# EAGLE design untitled (EAGLE 9.6.2)
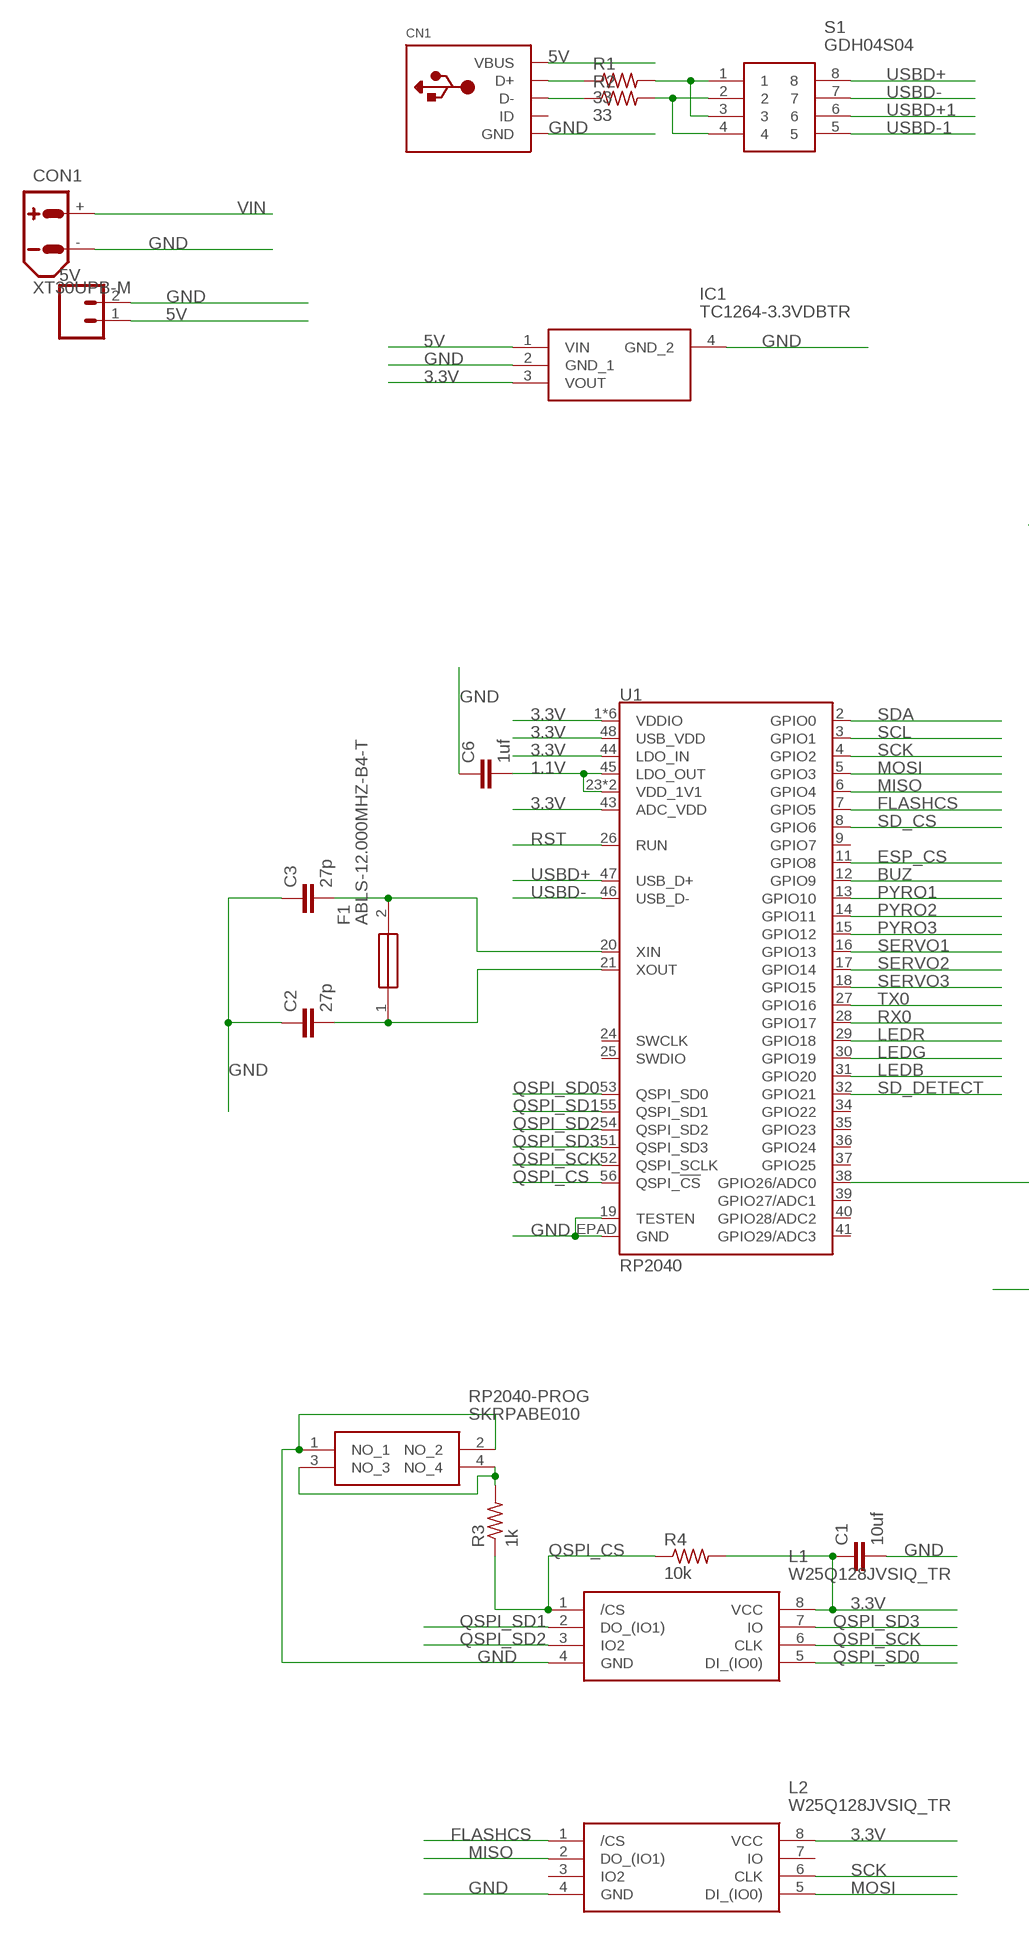
[diagram p0: schematic, sheet 1, part 1 of 2]
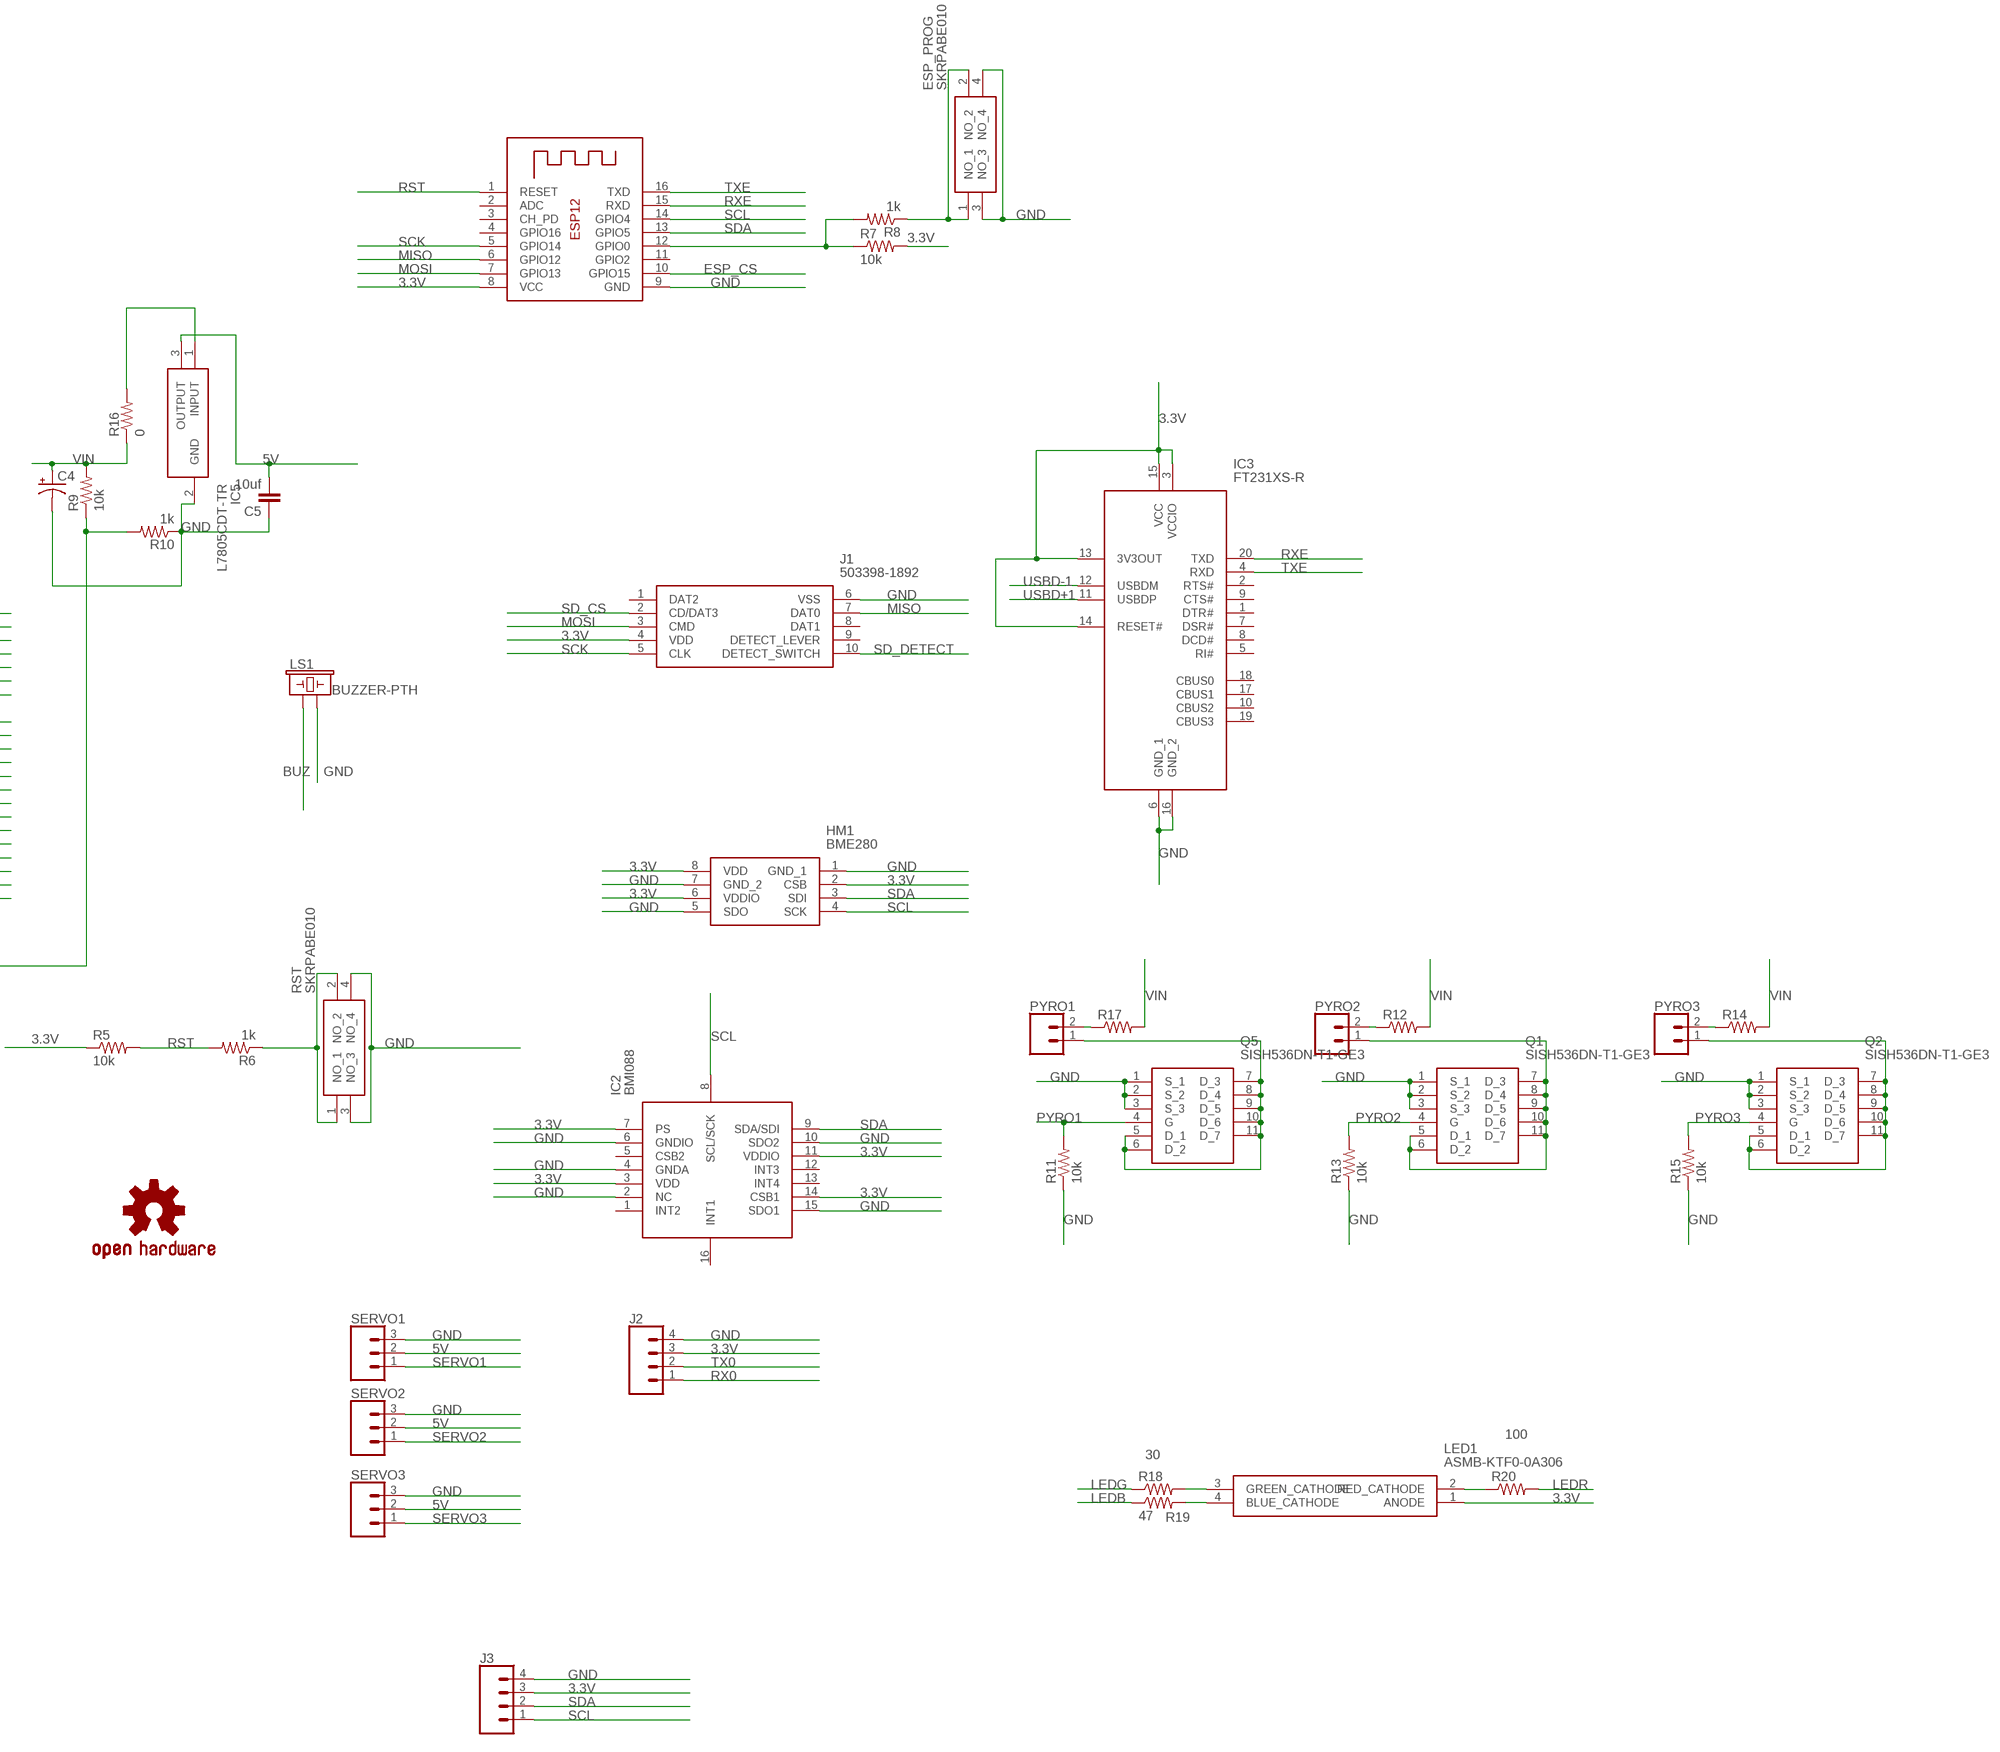
[diagram p1: schematic, sheet 1, part 2 of 2]

## Parts
5V  CONN_02  [1X02]
C1  10uf  C-EUC0805  [C0805]
C2  27p  C-EUC0805  [C0805]
C3  27p  C-EUC0805  [C0805]
C4  CPOL-USE3.5-8  [E3,5-8]
C5  10uf  C-EUC0805  [C0805]
C6  1uf  C-EUC0805  [C0805]
CN1  USBMINIB  [USB-MINIB]
CON1  XT30UPB-M  [XT30UPB-M]
ESP_PROG  SKRPABE010  [SKRPABE010]
F1  ABLS-12.000MHZ-B4-T  [HC/49US-(AT49)_1]
HM1  BME280  [BME280]
IC1  TC1264-3.3VDBTR  [SOT230P700X180-4N]
IC2  BMI088  [BMI088]
IC3  FT231XS-R  [SOP64P599X175-20N]
IC5  L7805CDT-TR  [L7805CDTTR]
J1  503398-1892  [503398-1892]
J2  CONN_04  [1X04]
J3  CONN_04  [1X04]
L1  W25Q128JVSIQ_TR  [SOIC127P780X195-8N]
L2  W25Q128JVSIQ_TR  [SOIC127P780X195-8N]
LED1  ASMB-KTF0-0A306  [ASMBKTF00A306]
LOGO1  OSHW-LOGOS  [OSHW-LOGO-S]
LS1  BUZZER-PTH  [BUZZER-12MM]
PYRO1  CONN_025MM  [SCREWTERMINAL-5MM-2]
PYRO2  CONN_025MM  [SCREWTERMINAL-5MM-2]
PYRO3  CONN_025MM  [SCREWTERMINAL-5MM-2]
Q1  SISH536DN-T1-GE3  [SQSA80ENWT1_GE3]
Q2  SISH536DN-T1-GE3  [SQSA80ENWT1_GE3]
Q5  SISH536DN-T1-GE3  [SQSA80ENWT1_GE3]
R1  33  R-US_M0805  [M0805]
R2  33  R-US_M0805  [M0805]
R3  1k  R-US_M0805  [M0805]
R4  10k  R-US_M0805  [M0805]
R5  10k  R-US_M0805  [M0805]
R6  1k  R-US_M0805  [M0805]
R7  10k  R-US_M0805  [M0805]
R8  1k  R-US_M0805  [M0805]
R9  10k  R-US_M0805  [M0805]
R10  1k  R-US_M0805  [M0805]
R11  10k  R-US_M0805  [M0805]
R12  0  R-US_R2512  [R2512]
R13  10k  R-US_M0805  [M0805]
R14  0  R-US_R2512  [R2512]
R15  10k  R-US_M0805  [M0805]
R16  0  R-US_R2512  [R2512]
R17  0  R-US_R2512  [R2512]
R18  30  R-US_M0805  [M0805]
R19  47  R-US_M0805  [M0805]
R20  100  R-US_M0805  [M0805]
RP2040-PROG  SKRPABE010  [SKRPABE010]
RST  SKRPABE010  [SKRPABE010]
S1  GDH04S04  [SOIC127P813X256-8N]
SERVO1  CONN_03  [1X03]
SERVO2  CONN_03  [1X03]
SERVO3  CONN_03  [1X03]
U1  RP2040  [QFN-56]
X1  ESP-12  [ESP-12]

## Nets
1.1V: C6.2 U1.23(VDD_1V1) U1.45(LDO_OUT) U1.50(VDD_1V1)
3.3V: C1.1 HM1.2(CSB) HM1.6(VDDIO) HM1.8(VDD) IC1.3(VOUT) IC2.3(VDD) IC2.7(PS) IC2.11(VDDIO) IC2.14(CSB1) IC3.3(VCCIO) IC3.13(3V3OUT) IC3.14(RESET#) IC3.15(VCC) J1.4(VDD) J2.3 J3.3 L1.8(VCC) L2.8(VCC) LED1.1(ANODE) R4.2 R5.1 R7.2 U1.1(VDDIO) U1.10(VDDIO) U1.22(VDDIO) U1.33(VDDIO) U1.42(VDDIO) U1.43(ADC_VDD) U1.44(LDO_IN) U1.48(USB_VDD) U1.49(VDDIO) X1.8(VCC)
5V: 5V.1 C5.2 CN1.VBUS IC1.1(VIN) IC5.3(OUTPUT) SERVO1.2 SERVO2.2 SERVO3.2
BUZ: LS1.+ U1.12(GPIO9)
ESP_CS: U1.11(GPIO8) X1.10(GPIO15)
FLASHCS: L2.1(/CS) U1.7(GPIO5)
GND: 5V.2 C1.2 C2.1 C3.1 C4.- C5.1 C6.1 CN1.GND CON1.- ESP_PROG.3(NO_3) ESP_PROG.4(NO_4) HM1.1(GND_1) HM1.5(SDO) HM1.7(GND_2) IC1.2(GND_1) IC1.4(GND_2) IC2.2(NC) IC2.4(GNDA) IC2.6(GNDIO) IC2.10(SDO2) IC2.15(SDO1) IC3.6(GND_1) IC3.16(GND_2) IC5.2(GND) J1.6(VSS) J2.4 J3.4 L1.4(GND) L2.4(GND) LS1.- Q1.1(S_1) Q1.2(S_2) Q1.3(S_3) Q2.1(S_1) Q2.2(S_2) Q2.3(S_3) Q5.1(S_1) Q5.2(S_2) Q5.3(S_3) R10.1 R11.1 R13.1 R15.1 RP2040-PROG.1(NO_1) RP2040-PROG.2(NO_2) RST.3(NO_3) RST.4(NO_4) SERVO1.3 SERVO2.3 SERVO3.3 U1.19(TESTEN) U1.EPAD(GND) X1.9(GND)
LEDB: R19.1 U1.31(GPIO20)
LEDG: R18.1 U1.30(GPIO19)
LEDR: R20.2 U1.29(GPIO18)
MISO: J1.7(DAT0) L2.2(DO_(IO1)) U1.6(GPIO4) X1.6(GPIO12)
MOSI: J1.3(CMD) L2.5(DI_(IO0)) U1.5(GPIO3) X1.7(GPIO13)
N$1: PYRO2.2 R12.1
N$2: R3.2 RP2040-PROG.3(NO_3) RP2040-PROG.4(NO_4)
N$3: ESP_PROG.1(NO_1) ESP_PROG.2(NO_2) R8.1
N$4: R6.1 RST.1(NO_1) RST.2(NO_2)
N$5: CN1.D+ R1.1
N$6: CN1.D- R2.1
N$7: PYRO2.1 Q1.5(D_1) Q1.6(D_2) Q1.7(D_3) Q1.8(D_4) Q1.9(D_5) Q1.10(D_6) Q1.11(D_7)
N$8: PYRO3.2 R14.1
N$9: PYRO1.1 Q5.5(D_1) Q5.6(D_2) Q5.7(D_3) Q5.8(D_4) Q5.9(D_5) Q5.10(D_6) Q5.11(D_7)
N$10: R7.1 R8.2 X1.12(GPIO0)
N$11: PYRO3.1 Q2.5(D_1) Q2.6(D_2) Q2.7(D_3) Q2.8(D_4) Q2.9(D_5) Q2.10(D_6) Q2.11(D_7)
N$13: R1.2 S1.1 S1.3
N$14: IC5.1(INPUT) R16.2
N$16: PYRO1.2 R17.1
N$17: R2.2 S1.2 S1.4
N$18: C3.2 F1.2 U1.20(XIN)
N$19: C2.2 F1.1 U1.21(XOUT)
N$23: LED1.3(GREEN_CATHODE) R18.2
N$24: R9.1 R10.2 U1.38(GPIO26/ADC0)
N$25: LED1.4(BLUE_CATHODE) R19.2
N$26: LED1.2(RED_CATHODE) R20.1
PYRO1: Q5.4(G) R11.2 U1.13(GPIO10)
PYRO2: Q1.4(G) R13.2 U1.14(GPIO11)
PYRO3: Q2.4(G) R15.2 U1.15(GPIO12)
QSPI_CS: L1.1(/CS) R3.1 R4.1 U1.56(QSPI_!CS!)
QSPI_SCK: L1.6(CLK) U1.52(QSPI_SCLK)
QSPI_SD0: L1.5(DI_(IO0)) U1.53(QSPI_SD0)
QSPI_SD1: L1.2(DO_(IO1)) U1.55(QSPI_SD1)
QSPI_SD2: L1.3(IO2) U1.54(QSPI_SD2)
QSPI_SD3: L1.7(IO) U1.51(QSPI_SD3)
RST: R5.2 R6.2 U1.26(RUN) X1.1(RESET)
RX0: J2.1 U1.28(GPIO17)
RXE: IC3.20(TXD) X1.15(RXD)
SCK: J1.5(CLK) L2.6(CLK) U1.4(GPIO2) X1.5(GPIO14)
SCL: HM1.4(SCK) IC2.8(SCL/SCK) J3.1 U1.3(GPIO1) X1.14(GPIO4)
SD_CS: J1.2(CD/DAT3) U1.8(GPIO6)
SD_DETECT: J1.10(DETECT_SWITCH) U1.32(GPIO21)
SDA: HM1.3(SDI) IC2.9(SDA/SDI) J3.2 U1.2(GPIO0) X1.13(GPIO5)
SERVO1: SERVO1.1 U1.16(GPIO13)
SERVO2: SERVO2.1 U1.17(GPIO14)
SERVO3: SERVO3.1 U1.18(GPIO15)
TX0: J2.2 U1.27(GPIO16)
TXE: IC3.4(RXD) X1.16(TXD)
USBD+: S1.8 U1.47(USB_D+)
USBD+1: IC3.11(USBDP) S1.6
USBD-: S1.7 U1.46(USB_D-)
USBD-1: IC3.12(USBDM) S1.5
VIN: C4.+ CON1.+ R9.2 R12.2 R14.2 R16.1 R17.2
Unconnected: CN1.ID IC2.1(INT2) IC2.5(CSB2) IC2.12(INT3) IC2.13(INT4) IC2.16(INT1) IC3.1(DTR#) IC3.2(RTS#) IC3.5(RI#) IC3.7(DSR#) IC3.8(DCD#) IC3.9(CTS#) IC3.10(CBUS2) IC3.17(CBUS1) IC3.18(CBUS0) IC3.19(CBUS3) J1.1(DAT2) J1.8(DAT1) J1.9(DETECT_LEVER) L2.3(IO2) L2.7(IO) U1.9(GPIO7) U1.24(SWCLK) U1.25(SWDIO) U1.34(GPIO22) U1.35(GPIO23) U1.36(GPIO24) U1.37(GPIO25) U1.39(GPIO27/ADC1) U1.40(GPIO28/ADC2) U1.41(GPIO29/ADC3) X1.2(ADC) X1.3(CH_PD) X1.4(GPIO16) X1.11(GPIO2)

## Library data of the parts
5V = SparkFun-Connectors:CONN_02: Multi connection point. Often used as Generic Header-pin footprint for 0.1 inch spaced/style header connections On any of the 0.1 inch spaced packages, you can populate with these: Break Away Headers - Straight <https://www.sparkfun.com/products/116> (PRT-00116) Break Away Male Headers - Right Angle <https://www.sparkfun.com/products/553> (PRT-00553) Female Headers <https://www.sparkfun.com/products/115> (PRT-00115) Break Away Headers - Machine Pin <https://www.sparkfun.com/products/117> (PRT-00117) Break Away Female Headers - Swiss Machine Pin <https://www.sparkfun.com/products/743> (PRT-00743) For SCREWTERMINALS and SPRING TERMINALS visit here: Screw Terimnals on SparkFun.com <https://www.sparkfun.com/search/results?term=Screw+Terminals> (5mm/3.5mm/2.54mm spacing) This device is also useful as a general connection point to wire up your design to another part of your project. Our various solder wires solder well into these plated through hole pads. Hook-Up Wire - Assortment (Stranded, 22 AWG) <https://www.sparkfun.com/products/11375> (PRT-11375) Hook-Up Wire - Assortment (Solid Core, 22 AWG) <https://www.sparkfun.com/products/11367> (PRT-11367) View the entire wire category on our website here <https://www.sparkfun.com/categories/141> Special notes: Molex polarized connector foot print use with: PRT-08233 with associated crimp pins and housings. 2.54_SCREWTERM for use with PRT-10571. 3.5mm Screw Terminal footprints for PRT-08084 5mm Screw Terminal footprints for use with PRT-08432
C1-C3 C5 C6 = rcl:C-EU: CAPACITOR, European symbol; SPICEPREFIX: C
C4 = rcl:CPOL-US: POLARIZED CAPACITOR, American symbol; SPICEPREFIX: C
CN1 = adafruit:USB: USB Connectors USBMINIB - Surface Mount Female Mini-B USB Connector 4UConnector: 06564 By microbuilder.eu Thru-hole RA Female Mini-B USB Connector 4UConnector: 18732 By ladyada.net
CON1 = amass:XT30: AMASS XT30 connector Store in Japan AMASS XT30 connector <https://szc.jp/ams-xt30>
ESP_PROG RP2040-PROG RST = SKRPABE010:SKRPABE010: Switch Tactile N.O. SPST Button J-Bend 0.05A 16VDC 1.57N SMD Automotive T/R Source: Datasheet <https://datasheet.lcsc.com/szlcsc/ALPS-Electric-SKRPABE010_C115360.pdf>; DESCRIPTION: Switch Tactile N.O. SPST Button J-Bend 0.05A 16VDC 1.57N SMD Automotive T/R; HEIGHT: 2.5mm; MANUFACTURER_NAME: ALPS Electric; MANUFACTURER_PART_NUMBER: SKRPABE010; MOUSER_PART_NUMBER: 688-SKRPAB; MOUSER_PRICE-STOCK: https://www.mouser.co.uk/ProductDetail/Alps-Alpine/SKRPABE010?qs=m0BA540hBPe1GpcSf%2FZ5Yw%3D%3D
F1 = ABLS-12.000MHZ-B4-T:ABLS-12.000MHZ-B4-T: ABRACON - ABLS-12.000MHZ-B4-T - CRYSTAL, 12MHZ, 18PF, HC-49US Source: Datasheet <https://componentsearchengine.com/Datasheets/2/ABLS-12.000MHZ-B4-T.pdf>; DESCRIPTION: ABRACON - ABLS-12.000MHZ-B4-T - CRYSTAL, 12MHZ, 18PF, HC-49US; HEIGHT: mm; MANUFACTURER_NAME: ABRACON; MANUFACTURER_PART_NUMBER: ABLS-12.000MHZ-B4-T; MOUSER_PART_NUMBER: 815-ABLS-12.0M-T; MOUSER_PRICE-STOCK: https://www.mouser.co.uk/ProductDetail/ABRACON/ABLS-12.000MHZ-B4-T?qs=yTU0IcKoRlGSQ8ooxPPVnQ%3D%3D
HM1 = BME280:BME280: Board Mount Humidity Sensors Source: Datasheet <https://datasheet.datasheetarchive.com/originals/distributors/DKDS-24/462906.pdf>; DESCRIPTION: Board Mount Humidity Sensors; HEIGHT: mm; MANUFACTURER_NAME: BOSCH; MANUFACTURER_PART_NUMBER: BME280; MOUSER_PART_NUMBER: 262-BME280; MOUSER_PRICE-STOCK: https://www.mouser.co.uk/ProductDetail/Bosch-Sensortec/BME280?qs=2OnyuXx6vpj2fK9HX7qb3g%3D%3D
IC1 = TC1264-3.3VDBTR:TC1264-3.3VDBTR: LDO Voltage Regulators 800mA Fixed Output Source: Datasheet; DESCRIPTION: LDO Voltage Regulators 800mA Fixed Output; HEIGHT: 1.8mm; MANUFACTURER_NAME: Microchip; MANUFACTURER_PART_NUMBER: TC1264-3.3VDBTR; MOUSER_PART_NUMBER: 579-TC1264-3.3VDBTR; MOUSER_PRICE-STOCK: https://www.mouser.co.uk/ProductDetail/Microchip-Technology-Atmel/TC1264-3.3VDBTR?qs=EkZBwCRGcSs72PT5fOeaFg%3D%3D
IC2 = BMI088:BMI088: Inertial Measurement Unit Digital Output 2.5V/3.3V Automotive Source: Datasheet <https://datasheet.datasheetarchive.com/originals/distributors/Datasheets_SAMA/994c3bf88e91a9e9fead6a819d348e4d.pdf>; DESCRIPTION: Inertial Measurement Unit Digital Output 2.5V/3.3V Automotive; HEIGHT: 1.45mm; MANUFACTURER_NAME: BOSCH; MANUFACTURER_PART_NUMBER: BMI088; MOUSER_PART_NUMBER: 262-BMI088; MOUSER_PRICE-STOCK: https://www.mouser.co.uk/ProductDetail/Bosch-Sensortec/BMI088?qs=f9yNj16SXrIMFspTV6RB6Q%3D%3D
IC3 = FT231XS-R:FT231XS-R: FTDI Chip FT231XS-R, Interface RS232, RS422, RS485, SIE, UART 3MBd, 5 V, 20-pin, SSOP Source: Datasheet <https://datasheet.datasheetarchive.com/originals/distributors/Datasheets_SAMA/824938d1687833d6997706543241551a.pdf>; DESCRIPTION: FTDI Chip FT231XS-R, Interface RS232, RS422, RS485, SIE, UART 3MBd, 5 V, 20-pin, SSOP; HEIGHT: 1.753mm; MANUFACTURER_NAME: FTDI Chip; MANUFACTURER_PART_NUMBER: FT231XS-R; MOUSER_PART_NUMBER: 895-FT231XS-R; MOUSER_PRICE-STOCK: https://www.mouser.co.uk/ProductDetail/FTDI/FT231XS-R?qs=Gp1Yz1mis3WduRPsgrTbtg%3D%3D
IC5 = L7805CDT-TR:L7805CDT-TR: Linear Voltage Regulators 5.0V 1.0A Positive Source: Datasheet <https://componentsearchengine.com/Datasheets/2/L7805CDT-TR.pdf>; DESCRIPTION: Linear Voltage Regulators 5.0V 1.0A Positive; HEIGHT: 2.63mm; MANUFACTURER_NAME: STMicroelectronics; MANUFACTURER_PART_NUMBER: L7805CDT-TR; MOUSER_PART_NUMBER: 511-L7805CDT-TR; MOUSER_PRICE-STOCK: https://www.mouser.co.uk/ProductDetail/STMicroelectronics/L7805CDT-TR?qs=gq%2F78KzUDX67VndS%2FbSB4Q%3D%3D
J1 = 503398-1892:503398-1892: MicroSD SMT Push-Push 1.28mm height MicroSD SMT Push-Push 1.28mm height Source: Datasheet <http://www.molex.com/webdocs/datasheets/pdf/en-us//5033981892_MEMORY_CARD_SOCKET.pdf>; DESCRIPTION: MicroSD SMT Push-Push 1.28mm height MicroSD SMT Push-Push 1.28mm height; HEIGHT: mm; MANUFACTURER_NAME: Molex; MANUFACTURER_PART_NUMBER: 503398-1892; MOUSER_PART_NUMBER: 538-503398-1892; MOUSER_PRICE-STOCK: https://www.mouser.co.uk/ProductDetail/Molex/503398-1892?qs=b0v8CoHHvSMxV%252BW12iKaSg%3D%3D
J2 J3 = SparkFun-Connectors:CONN_04: Multi connection point. Often used as Generic Header-pin footprint for 0.1 inch spaced/style header connections On any of the 0.1 inch spaced packages, you can populate with these: Break Away Headers - Straight <https://www.sparkfun.com/products/116> (PRT-00116) Break Away Male Headers - Right Angle <https://www.sparkfun.com/products/553> (PRT-00553) Female Headers <https://www.sparkfun.com/products/115> (PRT-00115) Break Away Headers - Machine Pin <https://www.sparkfun.com/products/117> (PRT-00117) Break Away Female Headers - Swiss Machine Pin <https://www.sparkfun.com/products/743> (PRT-00743) For SCREWTERMINALS and SPRING TERMINALS visit here: Screw Terimnals on SparkFun.com <https://www.sparkfun.com/search/results?term=Screw+Terminals> (5mm/3.5mm/2.54mm spacing) This device is also useful as a general connection point to wire up your design to another part of your project. Our various solder wires solder well into these plated through hole pads. Hook-Up Wire - Assortment (Stranded, 22 AWG) <https://www.sparkfun.com/products/11375> (PRT-11375) Hook-Up Wire - Assortment (Solid Core, 22 AWG) <https://www.sparkfun.com/products/11367> (PRT-11367) View the entire wire category on our website here <https://www.sparkfun.com/categories/141> Special notes: Molex polarized connector foot print use with SKU : PRT-08231 with associated crimp pins and housings. 1MM SMD Version SKU: PRT-10208; PROD_ID: CONN-09696
L1 L2 = W25Q128JVSIQ_TR:W25Q128JVSIQ_TR: FLASH - NOR Memory IC 128Mb (16M x 8) SPI - Quad I/O 8-SOIC Source: Datasheet <http://www.winbond.com/resource-files/w25q128jv spi revc 11162016.pdf>; DESCRIPTION: FLASH - NOR Memory IC 128Mb (16M x 8) SPI - Quad I/O 8-SOIC; HEIGHT: 1.95mm; MANUFACTURER_NAME: Winbond; MANUFACTURER_PART_NUMBER: W25Q128JVSIQ TR; MOUSER_PART_NUMBER: 454-W25Q128JVSIQTR; MOUSER_PRICE-STOCK: https://www.mouser.co.uk/ProductDetail/Winbond/W25Q128JVSIQ-TR?qs=qSfuJ%252Bfl%2Fd7vTyLA9kNdGw%3D%3D
LED1 = ASMB-KTF0-0A306:ASMB-KTF0-0A306: Standard LEDs - SMD 2220 PLCC4 Tricolor Source: Datasheet <https://componentsearchengine.com/Datasheets/1/ASMB-KTF0-0A306.pdf>; DESCRIPTION: Standard LEDs - SMD 2220 PLCC4 Tricolor; HEIGHT: 2.1mm; MANUFACTURER_NAME: Avago Technologies; MANUFACTURER_PART_NUMBER: ASMB-KTF0-0A306; MOUSER_PART_NUMBER: 630-ASMB-KTF0-0A306; MOUSER_PRICE-STOCK: https://www.mouser.co.uk/ProductDetail/Broadcom-Avago/ASMB-KTF0-0A306?qs=j%252B1pi9TdxUYIaJsf%252B0lh6A%3D%3D
LOGO1 = SparkFun-Aesthetics:OSHW-LOGO: Open-Source Hardware (OSHW) Logo This logo indicates the piece of hardware it is found on incorporates a OSHW license and/or adheres to the definition of open source hardware found here: http://freedomdefined.org/OSHW
LS1 = SparkFun-Electromechanical:BUZZER: Buzzer Small round buzzers that operate around the audible 2kHz range. You can use these as speakers to create simple music or user interfaces. Variant Overview: PTH - Mini Speaker - PC Mount 12mm 2.048kHz <https://www.sparkfun.com/products/7950> PTH_KIT - Mini Speaker - PC Mount 12mm 2.048kHz <https://www.sparkfun.com/products/7950> KIT simplifies soldering by adding stop mask to one side of the pads. PTH_NO_SILK - Mini Speaker - PC Mount 12mm 2.048kHz <https://www.sparkfun.com/products/7950> No silkscreen indicator of buzzer outline. PTH_KIT_NO_SILK - Mini Speaker - PC Mount 12mm 2.048kHz <https://www.sparkfun.com/products/7950> KIT package w/o silkscreen SMD - Buzzer Audio Magnetic (CCV-084B16) SMD buzzer used on, e.g. the LilyPad Buzzer <https://www.sparkfun.com/products/8463> and RFID USB Reader <https://www.sparkfun.com/products/9963>. SMD_KIT - Buzzer Audio Magnetic (CCV-084B16) SMD Buzzer with elongated pins to make soldering easier. Used on the SparkFun Simon Says - Surface Mount Soldering Kit <https://www.sparkfun.com/products/10935>.; PROD_ID: COMP-08253; SF_SKU: COM-07950
PYRO1-PYRO3 = SparkFun-Connectors:CONN_02: Multi connection point. Often used as Generic Header-pin footprint for 0.1 inch spaced/style header connections On any of the 0.1 inch spaced packages, you can populate with these: Break Away Headers - Straight <https://www.sparkfun.com/products/116> (PRT-00116) Break Away Male Headers - Right Angle <https://www.sparkfun.com/products/553> (PRT-00553) Female Headers <https://www.sparkfun.com/products/115> (PRT-00115) Break Away Headers - Machine Pin <https://www.sparkfun.com/products/117> (PRT-00117) Break Away Female Headers - Swiss Machine Pin <https://www.sparkfun.com/products/743> (PRT-00743) For SCREWTERMINALS and SPRING TERMINALS visit here: Screw Terimnals on SparkFun.com <https://www.sparkfun.com/search/results?term=Screw+Terminals> (5mm/3.5mm/2.54mm spacing) This device is also useful as a general connection point to wire up your design to another part of your project. Our various solder wires solder well into these plated through hole pads. Hook-Up Wire - Assortment (Stranded, 22 AWG) <https://www.sparkfun.com/products/11375> (PRT-11375) Hook-Up Wire - Assortment (Solid Core, 22 AWG) <https://www.sparkfun.com/products/11367> (PRT-11367) View the entire wire category on our website here <https://www.sparkfun.com/categories/141> Special notes: Molex polarized connector foot print use with: PRT-08233 with associated crimp pins and housings. 2.54_SCREWTERM for use with PRT-10571. 3.5mm Screw Terminal footprints for PRT-08084 5mm Screw Terminal footprints for use with PRT-08432; SF_SKU: PRT-08432
Q1 Q2 Q5 = SISH536DN-T1-GE3:SISH536DN-T1-GE3: MOSFET N-CHANNEL 30-V (D-S) Source: Datasheet <https://www.vishay.com/docs/66834/sish536dn.pdf>; DESCRIPTION: MOSFET N-CHANNEL 30-V (D-S); HEIGHT: 1.12mm; MANUFACTURER_NAME: Vishay; MANUFACTURER_PART_NUMBER: SISH536DN-T1-GE3; MOUSER_PART_NUMBER: 78-SISH536DN-T1-GE3; MOUSER_PRICE-STOCK: https://www.mouser.co.uk/ProductDetail/Vishay-Siliconix/SISH536DN-T1-GE3?qs=DRkmTr78QATbyKNF%252BlMg2A%3D%3D
R1-R20 = resistor:R-US_: RESISTOR, American symbol
S1 = GDH04S04:GDH04S04: 4way half pitch surface mount DIL switch 4 Way Surface Mount DIP Switch 4P Source: Datasheet <http://www.te.com/commerce/DocumentDelivery/DDEController?Action=showdoc&DocId=Customer Drawing1571983C6pdfEnglishENG_CD_1571983_C6.pdf1571983-4>; DESCRIPTION: 4way half pitch surface mount DIL switch 4 Way Surface Mount DIP Switch 4P; HEIGHT: 2.56mm; MANUFACTURER_NAME: TE Connectivity; MANUFACTURER_PART_NUMBER: GDH04S04; MOUSER_PART_NUMBER: 506-GDH04S04; MOUSER_PRICE-STOCK: https://www.mouser.co.uk/ProductDetail/TE-Connectivity-Alcoswitch/GDH04S04?qs=wg6chLqwgwrFTPnUQOwjIg%3D%3D
SERVO1-SERVO3 = SparkFun-Connectors:CONN_03: Multi connection point. Often used as Generic Header-pin footprint for 0.1 inch spaced/style header connections On any of the 0.1 inch spaced packages, you can populate with these: Break Away Headers - Straight <https://www.sparkfun.com/products/116> (PRT-00116) Break Away Male Headers - Right Angle <https://www.sparkfun.com/products/553> (PRT-00553) Female Headers <https://www.sparkfun.com/products/115> (PRT-00115) Break Away Headers - Machine Pin <https://www.sparkfun.com/products/117> (PRT-00117) Break Away Female Headers - Swiss Machine Pin <https://www.sparkfun.com/products/743> (PRT-00743) Stackable Header - 3 Pin (Female, 0.1") <https://www.sparkfun.com/products/13875> (PRT-13875) For SCREWTERMINALS and SPRING TERMINALS visit here: Screw Terimnals on SparkFun.com <https://www.sparkfun.com/search/results?term=Screw+Terminals> (5mm/3.5mm/2.54mm spacing) This device is also useful as a general connection point to wire up your design to another part of your project. Our various solder wires solder well into these plated through hole pads. Hook-Up Wire - Assortment (Stranded, 22 AWG) <https://www.sparkfun.com/products/11375> (PRT-11375) Hook-Up Wire - Assortment (Solid Core, 22 AWG) <https://www.sparkfun.com/products/11367> (PRT-11367) View the entire wire category on our website here <https://www.sparkfun.com/categories/141> Special notes: Molex polarized connector foot print use with SKU : PRT-08232 with associated crimp pins and housings.
U1 = SparkFun-IC-Microcontroller:RP2040: Raspberry Pi RP2040 MCU 56-pin 32-bit Microcontroller with 264kB of SRAM and external flash support up to 16MB Getting Started with the RP2040 <https://pico.raspberrypi.org/getting-started/> Dual-core ARM Cortex M0+ processor, flexible clock running up to 133 MHz 264kB of SRAM, and QSPI control of common flash memory USB 1.1 Host and Device support Low-power sleep and dormant modes Drag & drop programming using mass storage over USB 26 multi-function GPIO pins 2×SPI, 2×I2C, 2×UART, 3×12-bit ADC, 16×controllable PWM channels Accurate clock and timer on-chip Temperature sensor Accelerated floating point libraries on-chip 8×Programmable IO (PIO) state machines for custom peripheral support; PROD_ID: IC-15502
X1 = adafruit:ESP-12

## Board
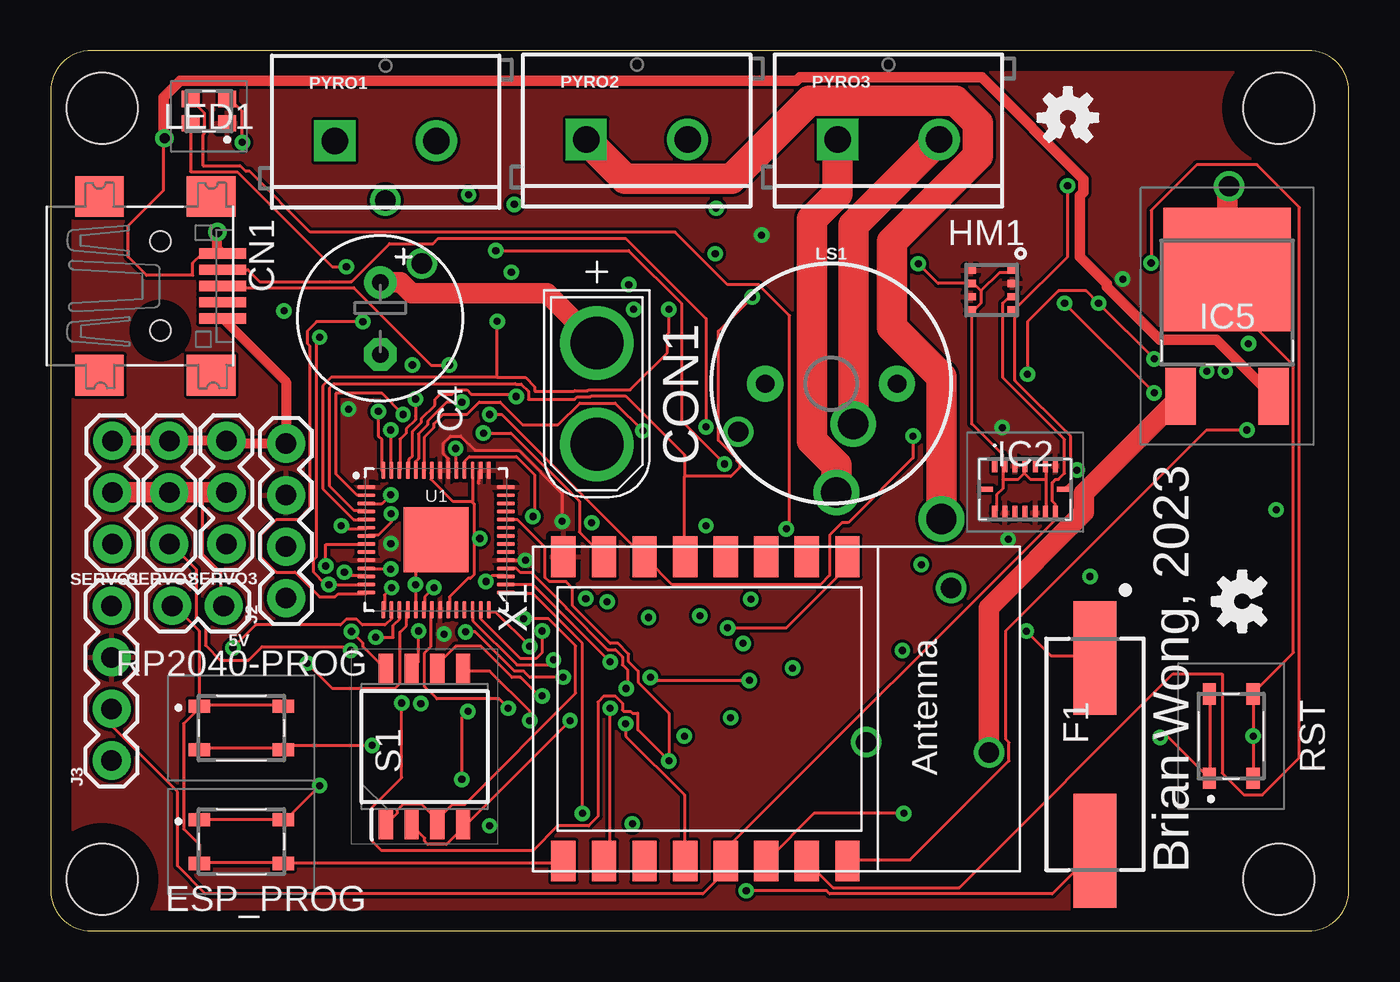
[diagram p2: board, top side]
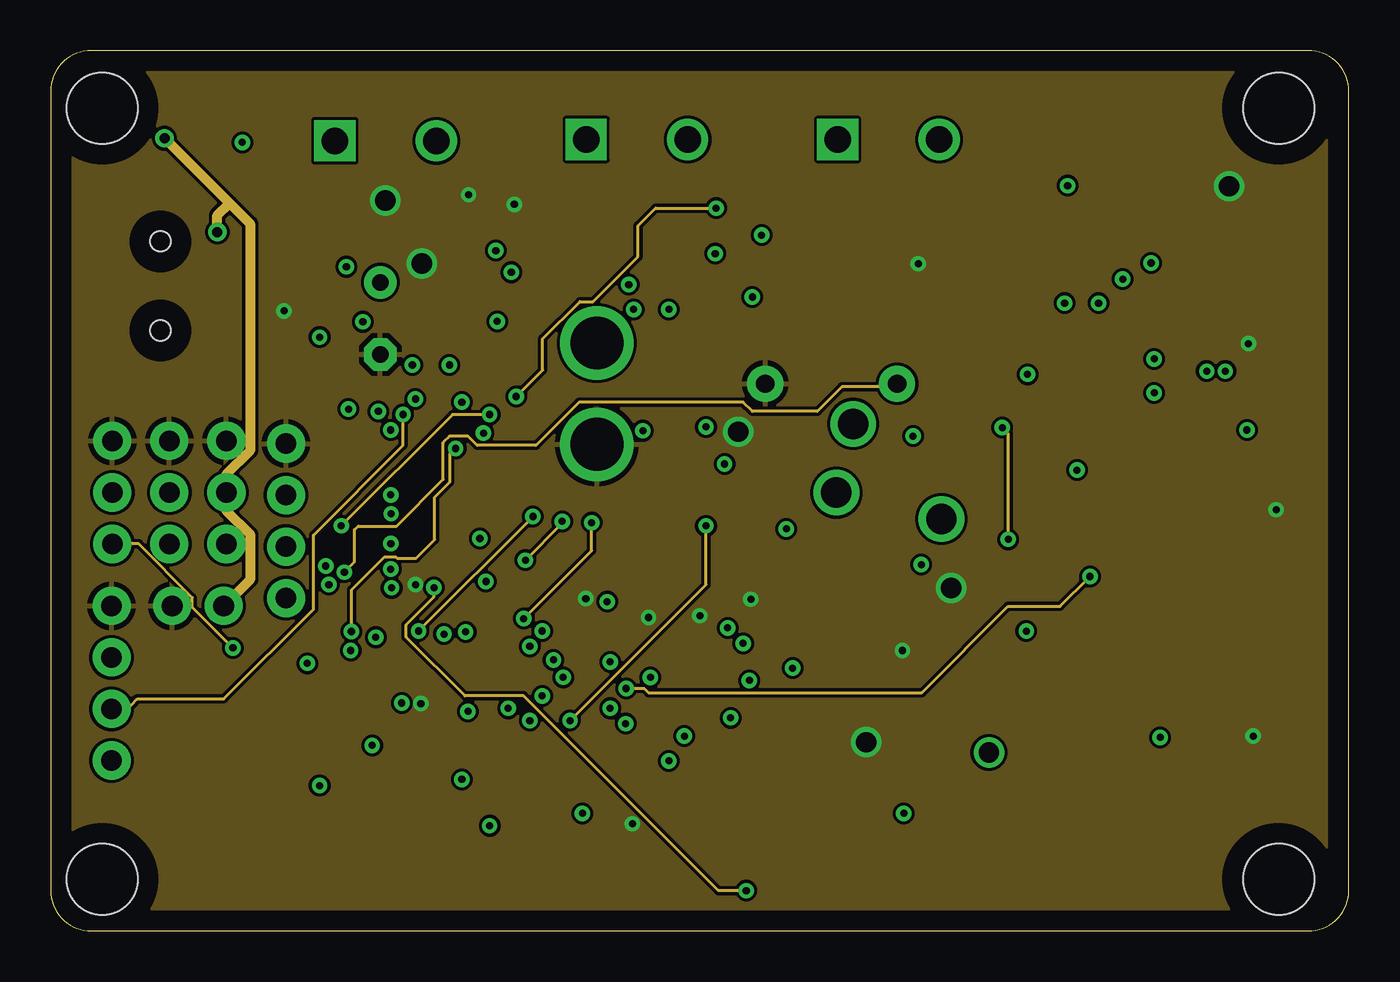
[diagram p3: board, inner layer Route2]
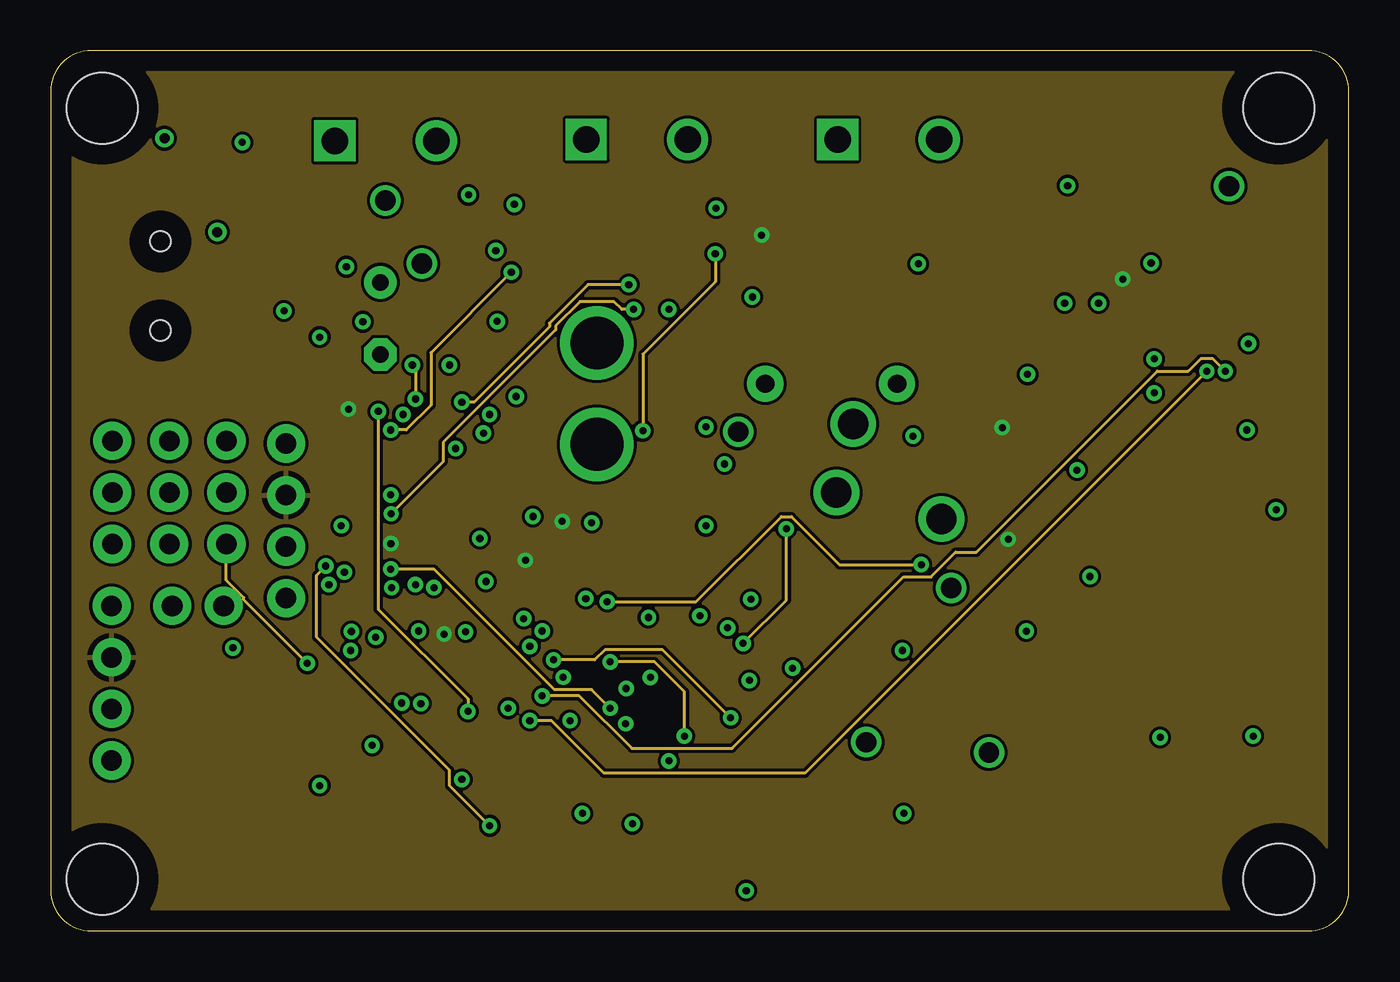
[diagram p4: board, inner layer Route15]
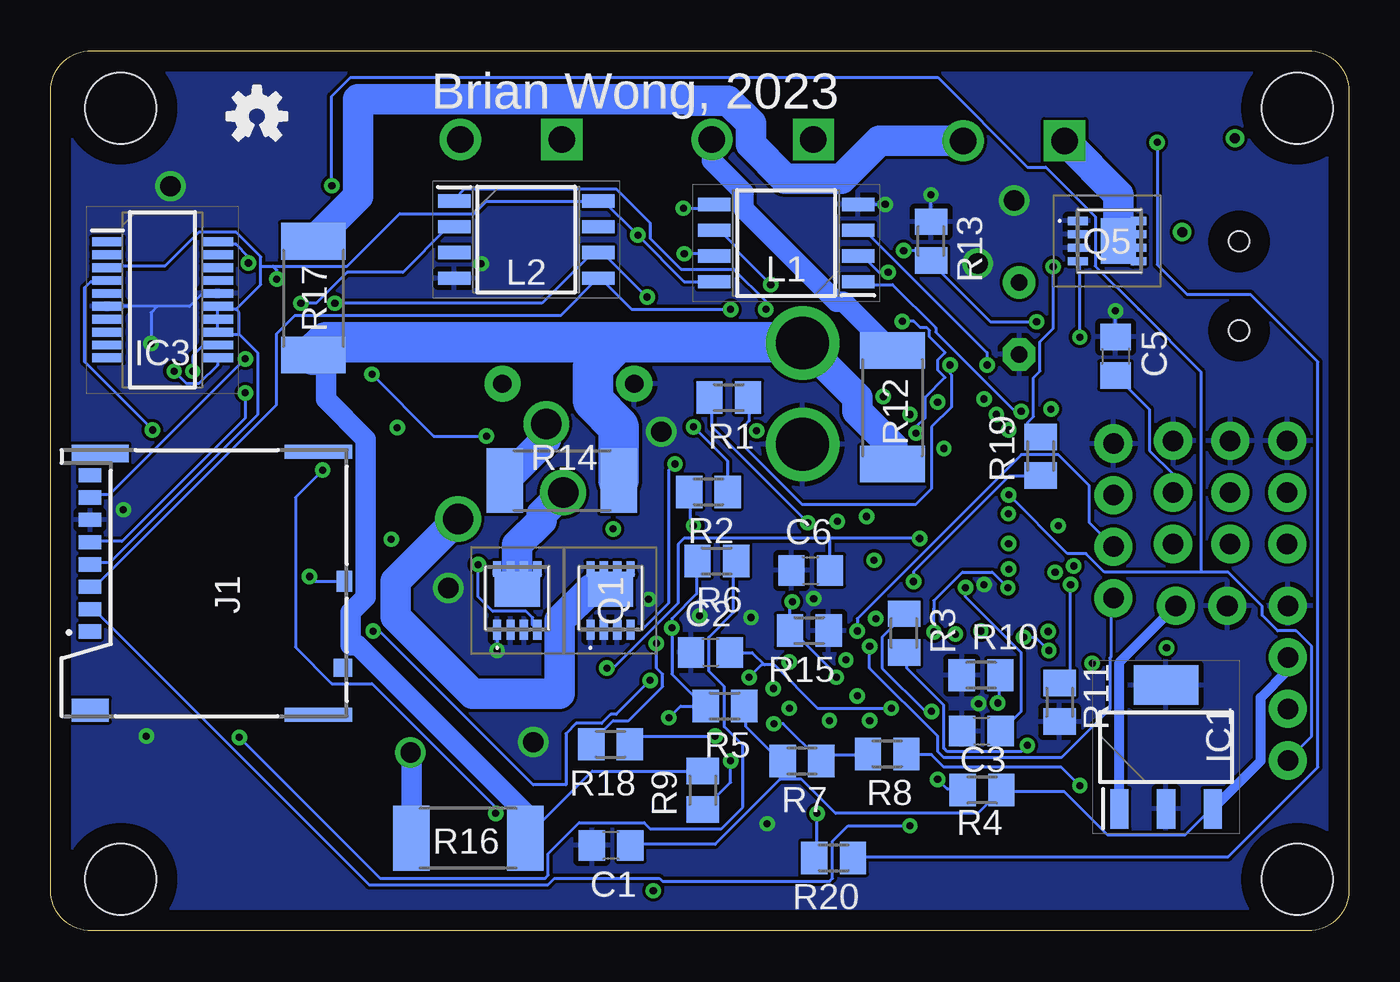
[diagram p5: board, bottom side, seen from below]

Size 64 x 43.38 mm. Coordinates in mm from the lower left corner, seen from the top.
Outline: 0,41.38 0,2 arc90 2,0 62,0 arc90 64,2 64,41.38 arc90 62,43.38 2,43.38 arc90 0,41.38
Copper layers (1+2*15+16): Top 0.035mm / dielectric 1.5mm / Route2 0.035mm / dielectric 0.15mm / Route15 0.035mm / dielectric 0.2mm / Bottom 0.035mm
Design rules "default *": minimum track width 6mil, minimum drill 0.35mm, track to track 6mil, track to pad 6mil, pad to pad 6mil, via to via 6mil, smd to smd 6mil, copper to edge 40mil, drill to drill 6mil, minimum pad ring 10mil, minimum via ring 8mil, stop-mask expansion 4mil, vias tented up to drill 15mil, thermal gap 10mil
Holes 3.5 mm at 2.54,2.54 2.54,40.54 60.54,2.54 60.54,40.54

### Footprints (pad centres in the part's own frame; a part is rotated, then mirrored left to right if it is on the bottom)
1X02 = drill 1.016 pad 1.88: 1 0,0; 2 2.54,0
C0805 = smd 1.3 x 1.5: 1 -0.95,0; 2 0.95,0
E3,5-8 = drill 0.813 pad 1.6: + -1.778,0 | drill 0.813 pad 1.6 octagon: - 1.778,0
USB-MINIB = smd 0.5 x 2.308: D+ 0,4.064; D- -0.8,4.064; GND 1.6,4.064; ID 0.8,4.064; VBUS -1.6,4.064 | smd 2 x 2.4: GND1 -4.4,-2; GND2 -4.4,3.5; GND3 4.4,3.5; GND4 4.4,-2 | hole 1: -2.2,1; 2.2,1
XT30UPB-M = drill 2.6: + 2.5,0; - -2.5,0
SKRPABE010 = smd 1.05 x 0.65: 1 -2.075,1.075; 2 2.075,1.075; 3 -2.075,-1.075; 4 2.075,-1.075
HC/49US-(AT49)_1 = smd 5.6 x 2.1: 1 -4.75,0; 2 4.75,0
BME280 = smd 0.5 x 0.35: 1 2.05,0; 2 2.05,-0.65; 3 2.05,-1.3; 4 2.05,-1.95; 5 0,-1.95; 6 0,-1.3; 7 0,-0.65; 8 0,0
SOT230P700X180-4N = smd 1.95 x 0.9: 1 -3.05,2.3; 2 -3.05,0; 3 -3.05,-2.3 | smd 1.95 x 3.2: 4 3.05,0
BMI088 = smd 0.25 x 0.675: 1 -1.5,1.165; 2 -1,1.165; 3 -0.5,1.165; 4 0,1.165; 5 0.5,1.165; 6 1,1.165; 7 1.5,1.165; 9 1.5,-1.165; 10 1,-1.165; 11 0.5,-1.165; 12 0,-1.165; 13 -0.5,-1.165; 14 -1,-1.165; 15 -1.5,-1.165 | smd 0.675 x 0.25: 8 1.915,0; 16 -1.915,0
SOP64P599X175-20N = smd 1.526 x 0.435: 1 -2.712,2.858; 2 -2.712,2.222; 3 -2.712,1.588; 4 -2.712,0.952; 5 -2.712,0.318; 6 -2.712,-0.318; 7 -2.712,-0.952; 8 -2.712,-1.588; 9 -2.712,-2.222; 10 -2.712,-2.858; 11 2.712,-2.858; 12 2.712,-2.222; 13 2.712,-1.588; 14 2.712,-0.952; 15 2.712,-0.318; 16 2.712,0.318; 17 2.712,0.952; 18 2.712,1.588; 19 2.712,2.222; 20 2.712,2.858
L7805CDTTR = smd 1.5 x 2.8: 1 -2.286,-6.25; 3 2.286,-6.25 | smd 6.3 x 6.1: 2 0,0
503398-1892 = smd 0.7 x 1.1: 1 4.17,-1.4; 2 5.27,-1.4; 3 6.37,-1.4; 4 7.47,-1.4; 5 8.57,-1.4; 6 9.67,-1.4; 7 10.77,-1.4; 8 11.87,-1.4 | smd 0.9 x 0.93: 9 2.38,-13.865 | smd 1.05 x 0.78: 10 6.645,-13.94 | smd 0.7 x 3.33: 11 13.03,-12.665; 14 0.07,-12.665 | smd 0.86 x 2.8: 12 12.95,-1.9 | smd 1.14 x 1.83: 13 0.29,-1.415
1X04 = drill 1.016 pad 1.88: 1 0,0; 2 2.54,0; 3 5.08,0; 4 7.62,0
SOIC127P780X195-8N = smd 1.6 x 0.65: 1 -3.55,1.905; 2 -3.55,0.635; 3 -3.55,-0.635; 4 -3.55,-1.905; 5 3.55,-1.905; 6 3.55,-0.635; 7 3.55,0.635; 8 3.55,1.905
ASMBKTF00A306 = smd 0.9 x 0.8: 1 0.9,-0.6; 2 0.9,0.6; 3 -0.9,0.6; 4 -0.9,-0.6
BUZZER-12MM = drill 0.9 pad 1.778: + 3.25,0; - -3.25,0
SCREWTERMINAL-5MM-2 = drill 1.3 pad 2.032 square: 1 0,0 | drill 1.3 pad 2.032: 2 5,0
SQSA80ENWT1_GE3 = smd 0.99 x 0.405: 1 -1.555,0.99; 2 -1.555,0.33; 3 -1.555,-0.33; 4 -1.555,-0.99 | smd 0.51 x 0.405: 5 1.555,-0.99; 6 1.555,-0.33; 7 1.555,0.33; 8 1.555,0.99 | smd 1.725 x 2.235: 9 0.438,0 | smd 0.25 x 0.075: 10 1.175,1.155; 11 1.175,-1.155
M0805 = smd 1.3 x 1.6: 1 -0.95,0; 2 0.95,0
R2512 = smd 1.8 x 3.2: 1 -2.8,0; 2 2.8,0
SOIC127P813X256-8N = smd 1.475 x 0.7: 1 -3.838,1.905; 2 -3.838,0.635; 3 -3.838,-0.635; 4 -3.838,-1.905; 5 3.838,-1.905; 6 3.838,-0.635; 7 3.838,0.635; 8 3.838,1.905
1X03 = drill 1.016 pad 1.88: 1 0,0; 2 2.54,0; 3 5.08,0
QFN-56 = smd 0.875 x 0.2: 1 -3.437,2.6; 2 -3.437,2.2; 3 -3.437,1.8; 4 -3.437,1.4; 5 -3.437,1; 6 -3.437,0.6; 7 -3.437,0.2; 8 -3.437,-0.2; 9 -3.437,-0.6; 10 -3.437,-1; 11 -3.437,-1.4; 12 -3.437,-1.8; 13 -3.437,-2.2; 14 -3.437,-2.6; 29 3.437,-2.6; 30 3.437,-2.2; 31 3.437,-1.8; 32 3.437,-1.4; 33 3.437,-1; 34 3.437,-0.6; 35 3.437,-0.2; 36 3.437,0.2; 37 3.437,0.6; 38 3.437,1; 39 3.437,1.4; 40 3.437,1.8; 41 3.437,2.2; 42 3.437,2.6 | smd 0.2 x 0.875: 15 -2.6,-3.437; 16 -2.2,-3.437; 17 -1.8,-3.437; 18 -1.4,-3.437; 19 -1,-3.437; 20 -0.6,-3.437; 21 -0.2,-3.437; 22 0.2,-3.437; 23 0.6,-3.437; 24 1,-3.437; 25 1.4,-3.437; 26 1.8,-3.437; 27 2.2,-3.437; 28 2.6,-3.437; 43 2.6,3.437; 44 2.2,3.437; 45 1.8,3.437; 46 1.4,3.437; 47 1,3.437; 48 0.6,3.437; 49 0.2,3.437; 50 -0.2,3.437; 51 -0.6,3.437; 52 -1,3.437; 53 -1.4,3.437; 54 -1.8,3.437; 55 -2.2,3.437; 56 -2.6,3.437 | smd 3.2 x 3.2: EPAD 0,0
ESP-12 = smd 2 x 1.2: 1 -7.5,4.5; 2 -7.5,2.5; 3 -7.5,0.5; 4 -7.5,-1.5; 5 -7.5,-3.5; 6 -7.5,-5.5; 7 -7.5,-7.5; 8 -7.5,-9.5; 9 7.5,-9.5; 10 7.5,-7.5; 11 7.5,-5.5; 12 7.5,-3.5; 13 7.5,-1.5; 14 7.5,0.5; 15 7.5,2.5; 16 7.5,4.5

### Placement (x,y rotation side)
5V  8.53,16.02 180 top
C1  36.37,4.21 180 bottom
C2  31.48,13.73 0 bottom
C3  18.12,9.85 0 bottom
C4  16.25,30.19 270 top
C5  11.5,28.33 270 bottom
C6  26.53,17.77 0 bottom
CN1  4.41,31.79 270 top
CON1  26.93,26.48 90 top
ESP_PROG  9.4,4.4 0 top
F1  51.48,8.7 270 top
HM1  45.37,32.56 0 top
IC1  9.01,9.06 90 bottom
IC2  48.04,21.77 0 top
IC3  58.49,31.1 0 bottom
IC5  58,32.6 0 top
J1  63.46,10.59 90 bottom
J2  11.6,16.4 90 top
J3  3,8.4 90 top
L1  27.74,33.9 180 bottom
L2  40.56,34.07 0 bottom
LED1  7.8,40.4 0 top
LOGO1  50.15,40.08 0 top
LOGO2  OSHW-LOGOS  [OSHW-LOGO-S]  53.83,40.15 0 bottom
LOGO3  OSHW-LOGOS  [OSHW-LOGO-S]  58.74,16.24 90 top
LS1  38.48,26.97 0 top
PYRO1  14.01,38.94 0 top
PYRO2  26.4,39 0 top
PYRO3  38.8,39 0 top
Q1  36.4,16.4 90 bottom
Q2  41,16.4 90 bottom
Q5  11.8,34 0 bottom
R1  30.57,26.29 180 bottom
R2  31.57,21.64 180 bottom
R3  21.93,14.68 270 bottom
R4  18.08,6.95 0 bottom
R5  30.76,11.08 180 bottom
R6  31.16,18.23 180 bottom
R7  26.96,8.38 180 bottom
R8  22.76,8.73 180 bottom
R9  31.85,6.93 90 bottom
R10  18.13,12.6 0 bottom
R11  14.26,11.27 90 bottom
R12  22.5,25.8 270 bottom
R13  20.6,34 270 bottom
R14  38.8,22.2 0 bottom
R15  26.6,14.8 180 bottom
R16  43.41,4.57 180 bottom
R17  51.05,31.19 270 bottom
R18  36.4,9.2 180 bottom
R19  15.2,23.4 90 bottom
R20  25.4,3.6 180 bottom
RP2040-PROG  9.4,10 0 top
RST  58.2,9.6 90 top
S1  18.43,9.09 90 top
SERVO1  3.04,19.07 90 top
SERVO2  5.85,19.07 90 top
SERVO3  8.66,19.07 90 top
U1  19,19.27 0 top
X1  34.78,10.94 270 top

### Tracks (layer width: path | path; a pad name or v marks a point on that pad's centre or on a via)
1.1V  (via drill 0.35)
  Top 0.152: 20.88,19.34 20.88,21.03 20.8,21.11 | 20.88,19.34 20.88,17.56 20.7,17.37 20.57,17.37 19.66,16.46 19.66,15.85 U1.23 | 20.8,21.11 20.73,21.18 19.82,21.18 18.75,22.25 18.75,22.55 U1.50 | 20.88,19.34 v21.16,19.34 | U1.45 20.8,21.11
  Bottom 0.152: v36.58,12.95 36.27,12.95 33.07,16.15 33.07,19.05 32.78,19.34 25.61,19.34 | v21.16,19.34 25.61,19.34 | C6.2 25.58,19.31 25.61,19.34
3.3V  (via drill 0.35)
  Top 0.152: 21.18,22.71 U1.44 21.18,22.71 | U1.33 v23.41,18.27 | 21.18,22.71 21.13,22.65 21.13,22.2 21.11,22.17 21.11,22.04 | U1.48 19.6,23.28 19.36,23.52 19.36,24.03 19.71,24.38 20.22,24.38 20.92,23.68 23.09,23.68 25.22,21.55 v25.22,20.18
  Route2 0.152: v47.21,19.3 47.21,24.51 v46.91,24.81 | v23.41,18.27 25.22,20.08 v25.22,20.18
  Bottom 0.152: L1.8 31.39,32 32.77,32 v35.05,34.29 36.88,36.12 L2.8 37.03,35.97 42.52,35.97 43.13,35.36 46.79,35.36 49.38,32.77 53.05,32.77 | 54.71,29.41 53.8,28.5 53.8,25.44 61.1,18.14 62.03,18.14 J1.4 | 54.71,29.41 55.63,29.41 IC3.13 IC3.14 IC3.15 55.63,30.63 54.86,30.63 | 54.86,30.63 54.71,30.48 54.71,29.41 | 53.65,32.77 53.65,31.85 54.86,30.63 | 53.65,32.77 53.65,33.22 54.86,34.44 56.69,34.44 58.37,32.77 61.11,32.77 IC3.3 | 53.65,32.77 53.05,32.77 | 28.04,7.47 31.24,4.27 35.36,4.27 C1.1 | 28.04,7.47 28.04,8.23 R7.2 28.04,8.38 29.72,10.06 29.72,10.97 R5.1 | IC1.3 6.86,5.94 8.08,4.72 11.89,4.72 14.02,6.86 17.07,6.86 R4.2 17.22,6.86 18.29,5.79 25.3,5.79 26.98,7.47 28.04,7.47 | v52.85,32.13 52.85,32.57 53.05,32.77
  Bottom 0.5: IC1.3 4.34,8.38 4.34,11.5 3,12.84 J3.3
  other vias: 14.68,25.72 16.77,19.09 19.39,14.63
  pour Top: -73.29,111.76 -73.29,-31.91 -58.88,-46.32 118.78,-46.32 168.91,3.81 168.91,105.41 162.56,111.76
  pour Route15: 66.8,52.4 71.2,48 71.2,-0.8 65.6,-6.4 27.8,-6.4 4.8,-6.4 -5.6,4 -5.8,4.2 -5.8,48.2 -1.6,52.4
5V  (via drill 0.5)
  Top 0.152: CN1.VBUS 8.38,33.38 7.47,33.38 7.01,32.92 7.01,32.31 4.72,32.31 3.81,33.22 3.81,34.75 5.56,36.5 5.56,39.12 | 50.79,33.19 50.75,33.22 | 50.75,36.8 50.75,37.03 45.87,41.91 32.54,41.91 | 7.47,21.61 7.47,18.59 8.38,17.68 8.38,16.15 5V.1
  Top 0.5: CN1.VBUS 8.21,33.64 v8.21,34.44
  Top 0.508: 50.79,33.19 52.07,31.91 52.07,31.76 54.68,29.14 57.46,29.14 60.26,26.35 IC5.3 | 50.75,33.22 50.75,36.23 50.92,36.4 50.92,37.05 45.9,42.08 36.93,42.08 36.77,41.91 32.54,41.91 6.38,41.91 5.56,41.09 5.56,39.12 v5.62,39.07
  Top 1: SERVO1.2 SERVO2.2 7.47,21.61 SERVO3.2
  Route2 0.5: v5.62,39.07 8.82,35.87 | 8.82,35.87 9.82,34.86 9.82,23.67 8.66,22.5 SERVO3.2 8.66,20.72 9.82,19.55 9.82,17.31 5V.1 | v8.21,34.44 8.21,35.27 8.82,35.87
  Bottom 0.152: 11.58,27.28 C5.2 9.83,25.71 9.83,23.67 8.66,22.5 SERVO3.2
  Bottom 0.5: IC1.1 11.31,13.24 5V.1
BUZ  (via drill 0.35)
  Top 0.152: v14.48,17.68 14.63,17.53 15.54,17.53 U1.12
  Route2 0.152: LS1.+ 41.6,26.82 39.01,26.82 37.8,25.6 34.59,25.6 34.14,26.06 26.06,26.06 23.93,23.93 21.03,23.93 20.57,24.38 19.66,24.38 19.36,24.08 19.36,22.25 17.06,19.95 15.16,19.95 14.98,19.78 14.98,18.18 v14.48,17.68
ESP_CS  (via drill 0.35)
  Top 0.152: v16.76,17.83 15.7,17.83 U1.11 | v27.58,10.97 27.58,3.66 27.43,3.5 X1.10
  Route15 0.152: v16.76,17.83 18.9,17.83 24.84,11.89 26.67,11.89 v27.58,10.97
FLASHCS  (via drill 0.35)
  Top 0.152: v16.78,20.56 16.78,20.14 16.15,19.51 15.7,19.51 U1.7
  Route15 0.152: v16.78,20.56 19.36,23.13 19.36,24.08 24.89,29.62 24.89,29.82 26.09,31.02 27.77,31.02 28.16,30.63 v28.74,30.63
  Bottom 0.152: v28.74,30.63 28.74,31.03 30.33,32.61 32.92,32.61 34.44,34.14 34.44,34.9 36.12,36.58 43.59,36.58 44.04,36.12 L2.1
GND  (via drill 0.35, 1)
  Top 0.152: 45.87,31.55 45.87,30.94 45.57,30.63 45.41,30.63 HM1.5 45.41,30.48 45.41,24.99 46.94,23.47 46.94,23.01 IC2.2 46.94,22.86 46.94,22.25 | 45.87,31.55 45.41,32 HM1.7 43.75,31.91 v42.78,32.88 | 45.87,31.55 46.79,32.46 47.4,32.46 HM1.1 | 49.07,22.25 49.07,22.86 IC2.6 | 49.07,22.25 49.07,20.73 IC2.10 | 46.94,22.25 46.94,21.79 46.63,21.49 46.63,20.73 IC2.15 46.48,20.57 | 48.01,22.55 48.01,22.86 IC2.4 | 48.01,22.55 47.7,22.25 46.94,22.25 | 49.07,22.25 48.31,22.25 48.01,22.55 | U1.19 17.98,15.85 v17.98,17.07 17.98,18.29 18.9,19.2 U1.EPAD | RST.3 59.28,7.62 v59.28,9.6 59.28,11.58 RST.4 59.28,11.73 61.27,13.72 61.27,27.89 58.06,31.09 58.06,32.46 IC5.2 | RP2040-PROG.1 7.47,11.12 11.43,11.12 RP2040-PROG.2 | RP2040-PROG.1 7.32,11.12 7.32,14.78 6.1,16 5V.2 | RP2040-PROG.1 7.32,10.97 6.55,10.21 6.55,5.03 7.32,4.27 7.32,3.35 ESP_PROG.3 7.47,3.35 11.43,3.35 ESP_PROG.4 11.58,3.35 25.15,3.35 X1.9 25.3,3.35
  Top 0.5: CN1.GND 11.6,27.06 J2.4 8.79,24.02 SERVO3.3 SERVO2.3 SERVO1.3
  Top 1: IC5.2 58,36.6 v58.1,36.7
  Bottom 0.152: 41.15,14.87 41.15,14.94 Q2.2 | Q2.1 v41.99,13.82 | C5.1 v11.5,30.56 | R13.1 v20.6,36.28 | L1.4 v22.86,35.8 | 58.74,30.79 57.15,30.79 56.54,31.39 55.78,31.39 IC3.16 | 58.74,30.79 61.11,30.79 IC3.6 | 58.74,30.79 59.05,30.47 v59.05,28.95
  other vias: 32,15.53 34.52,16.34 29.47,15.45 60.42,20.76 28.68,5.28 18.25,11.2 26.38,16.38 18.3,32.9 33.9,24.6 40.2,9.3 44.4,16.9 16.5,36
  pour Bottom: 0,104.14 -11.43,92.71 -11.43,80.01 -11.43,8.89 7.62,-10.16 152.4,-10.16 166.37,3.81 166.37,95.25 157.48,104.14
  pour Route2: 67.4,49 67.4,0.8 62.2,-4.4 3.6,-4.4 -2.8,2 -2.8,43.2 0,46 3,49
LEDB  (via drill 0.35)
  Top 0.152: v21.46,17.22 21.76,17.53 22.4,17.53 U1.31
  Bottom 0.152: v21.46,17.22 21.46,17.71 16.76,22.4 15.24,22.4 R19.1
LEDG  (via drill 0.35)
  Top 0.152: v27.58,13.26 23.77,17.07 22.55,17.07 U1.30
  Route15 0.152: v27.58,13.26 29.78,13.26 31.24,11.79 v31.24,9.6
  Bottom 0.152: v31.24,9.6 35.05,9.6 35.36,9.3 R18.1
LEDR  (via drill 0.35)
  Top 0.152: v26.21,5.79 26.21,14.17 23.77,16.61 22.55,16.61 U1.29
  Bottom 0.152: v26.21,5.79 26.21,3.66 R20.2
MISO  (via drill 0.35)
  Top 0.152: v14.33,19.96 14.48,19.81 15.54,19.81 U1.6 | v21.64,25.45 22.25,25.45 29.26,18.44 X1.6 29.41,18.29 30.63,17.07 37.95,17.07 38.41,17.53 38.41,19.51 39.01,20.12 39.32,20.12 42.52,23.32 v42.52,24.38 | v54.41,28.19 v51.66,30.94 51.05,31.55 49.68,31.55 48.16,30.02 v48.16,27.43
  Route2 0.152: v14.33,19.96 19.81,25.45 v21.64,25.45
  Bottom 0.152: v54.41,28.19 61.11,21.49 62.03,21.49 J1.7 | v51.66,30.94 50.9,30.94 49.38,32.46 46.63,32.46 44.5,34.59 44.2,34.59 L2.2 | v42.52,24.38 45.11,24.38 v48.16,27.43
MOSI  (via drill 0.35)
  Top 0.152: 22.02,27.28 23.4,27.28 23.86,26.82 23.86,26.6 25.81,26.6 25.83,26.63 26.48,26.63 26.52,26.67 28.57,26.67 30.4,28.5 30.4,29.4 30.48,29.48 v30.48,30.63 | 22.02,27.28 13.82,27.28 13.41,26.86 13.41,21.8 14.94,20.27 15.54,20.27 U1.5 | 22.02,27.28 v22.02,30.04 | X1.7 26.06,19.66 26.06,21.17 22.7,24.54 v21.34,24.54
  Bottom 0.152: v30.48,30.63 35.36,30.63 36.88,32.16 L2.5 37.03,32.16 38.86,30.33 51.97,30.33 52.88,29.41 52.88,25.91 61.72,17.07 62.03,17.07 J1.3 | v21.34,24.54 21.34,24.84 20.88,25.3 20.88,26.2 20.88,26.31 19.91,27.28 20.27,27.64 20.27,28.14 19.91,28.5 19.9,28.5 20.67,29.27 20.67,29.59 20.8,29.73 21.13,29.73 21.44,30.04 v22.02,30.04
N$1
  Bottom 1: R12.1 24.92,31.02 25.26,31.02 29.84,35.59 29.84,36.4 31.4,37.96 PYRO2.2
N$2  (via drill 0.35)
  Top 0.152: RP2040-PROG.3 7.47,8.99 11.43,8.99 RP2040-PROG.4 11.58,8.99 11.73,9.14 v15.85,9.14
  Bottom 0.152: v15.85,9.14 16.15,8.84 19.81,8.84 19.96,8.99 19.96,11.12 21.79,12.95 21.79,13.72 R3.2
N$3  (via drill 0.35)
  Top 0.152: ESP_PROG.1 7.47,5.49 11.43,5.49 ESP_PROG.2 11.58,5.49 v13.26,7.16
  Bottom 0.152: v13.26,7.16 14.17,8.08 19.96,8.08 20.57,8.69 21.79,8.69 R8.1
N$4  (via drill 0.35)
  Top 0.152: RST.2 57.15,11.58 57.15,7.62 RST.1 55.11,9.54 v54.7,9.54
  Bottom 0.152: v54.7,9.54 47.75,2.59 39.62,2.59 39.47,2.74 39.47,3.81 37.95,5.33 34.75,5.33 34.44,5.03 30.94,5.03 29.87,6.1 29.87,9.14 30.79,10.06 30.79,12.04 31.55,12.8 31.55,14.48 30.33,15.7 30.33,18.14 R6.1
N$5  (via drill 0.35)
  Top 0.152: v19.66,27.89 18.75,27.89 14.94,31.7 8.53,31.7 CN1.D+
  Bottom 0.152: R1.1 29.57,26.21 29.57,25.14 29.8,24.9 29.8,23.87 26.96,21.03 21.34,21.03 20.57,21.79 20.57,24.84 19.6,25.81 19.6,27.42 19.66,27.47 v19.66,27.89
N$6  (via drill 0.35)
  Top 0.152: v32.31,24.84 32.31,30.18 28.35,34.14 19.1,34.14 18.84,33.88 16.71,33.88 14.83,32 13.76,32 10.3,32 9.71,32.59 CN1.D-
  Bottom 0.152: v32.31,24.84 30.63,23.16 30.63,21.64 R2.1
N$7  (via drill 1.5)
  Top 1.5: PYRO2.1 28.32,37.08 33.57,37.08 37.41,40.92 44.59,40.92 45.72,39.8 45.72,38.2 41.49,33.97 41.49,29.75 43.92,27.32 v43.92,20.3
  Bottom 0.152: Q1.7 36.73,17.83 36.73,17.53 Q1.9 | Q1.9 37.49,17.53 37.49,17.83 Q1.8 37.39,17.74 Q1.10 | Q1.9 36.12,17.53 36.12,17.83 Q1.6 35.97,17.98 35.51,17.98 Q1.5 35.41,17.74 Q1.11
  Bottom 1.5: Q1.9 37.37,16.84 38.91,15.3 38.91,11.69 43.21,11.69 46.99,15.48 46.99,17.23 v43.92,20.3
N$8  (via drill 1.5)
  Top 1.5: v39.57,24.99 39.57,34.77 PYRO3.2
  Bottom 1.5: R14.1 39.57,24.23 v39.57,24.99
N$9
  Bottom 0.152: Q5.7 10.36,34.44 10.67,34.44 Q5.9 | Q5.9 10.67,35.05 10.36,35.05 Q5.8 10.46,34.99 Q5.10 | Q5.9 10.67,33.98 10.36,33.68 Q5.6 10.21,33.53 10.21,33.07 Q5.5 10.46,33.01 Q5.11
  Bottom 1.5: PYRO1.1 11.36,36.29 Q5.9
N$10  (via drill 0.35)
  Top 0.152: v28.35,10.21 28.35,9.6 31.24,6.71 31.24,3.5 X1.12
  Bottom 0.152: R8.2 23.77,8.69 25.6,8.69 25.91,8.38 R7.1 26.06,8.38 27.89,10.21 v28.35,10.21
N$11  (via drill 1.5)
  Top 1.5: PYRO3.1 38.8,36.34 37.54,35.08 37.54,24.15 38.74,22.95 v38.74,21.6
  Bottom 0.152: 40.69,17.98 40.08,17.98 Q2.5 40.01,17.48 40.29,17.21 40.21,17.21 Q2.11 | 40.69,17.98 Q2.6 | 40.69,17.98 41,17.98 41.3,17.98 | 41.3,17.98 Q2.7 | 41.3,17.98 41.91,17.98 Q2.8 42.16,17.79 Q2.10
  Bottom 1.5: v38.74,21.6 39.8,20.54 39.8,20.23 41,19.02 41,17.98 Q2.9
N$13  (via drill 0.35)
  Top 0.152: 19.05,5.49 19.2,5.33 S1.3 19.05,5.49 | 19.05,5.49 18.29,6.25 17.37,6.25 17.07,5.94 17.07,5.79 16.61,5.33 S1.1 | v23.32,15.39 24.54,15.39 25.89,14.04 25.89,11.71 20.42,6.25 19.81,6.25 19.05,5.49
  Route2 0.152: v26.67,20.12 26.67,18.75 v23.32,15.39
  Bottom 0.152: v26.67,20.12 31.39,24.84 31.39,26.21 R1.2
N$14  (via drill 1)
  Top 1: IC5.1 50.95,21.58 50.95,20.62 46.26,15.94 v46.26,8.8
  Bottom 1: R16.2 46.21,8.75 v46.26,8.8
N$16
  Bottom 1.5: PYRO1.2 23.15,38.94 25.01,37.08 27.79,37.08 29.48,38.77 29.48,39.8 30.61,40.92 32.48,40.92 32.54,40.98 48.83,40.98 48.83,36.21 R17.1
N$17  (via drill 0.35)
  Top 0.152: 20.42,5.18 19.51,4.27 18.59,4.27 18.44,4.42 18.44,4.57 17.83,5.18 S1.2 | 20.42,5.18 v25.6,10.36 | 20.42,5.18 S1.4
  Route2 0.152: v32.31,19.96 32.31,17.07 v25.6,10.36
  Bottom 0.152: v32.31,19.96 32.46,20.12 32.46,21.49 R2.2
N$18  (via drill 0.35)
  Top 0.152: v18.9,16.92 18.44,16.46 18.44,15.85 U1.20 | v34.29,1.98 38.25,1.98 38.41,1.83 49.38,1.83 51.36,3.81 F1.2
  Route2 0.152: v18.9,16.92 18.9,16.46 17.53,15.09 17.53,14.48 20.42,11.58 23.32,11.58 32.92,1.98 v34.29,1.98
  Bottom 0.152: v18.9,16.92 18.9,16.46 16.15,13.72 16.15,10.82 17.07,9.91 C3.2
N$19  (via drill 0.35)
  Top 0.152: v22.55,10.97 22.1,11.43 19.05,11.43 18.44,12.04 18.44,13.72 18.75,14.02 18.75,15.7 U1.21 | v48.1,14.78 49.32,13.56 51.36,13.56 F1.1 | v34.44,12.34 29.72,12.34 v29.57,12.5
  Bottom 0.152: v22.55,10.97 26.19,10.97 28.33,13.11 28.8,13.11 | 28.8,13.11 29.41,13.72 30.48,13.72 C2.2 | v48.1,14.78 47.8,14.78 40.22,7.2 38.6,7.2 38.6,9.72 38.09,10.23 36.84,10.23 36.4,10.67 36.12,10.67 v34.44,12.34 | v29.57,12.5 28.96,13.11 28.8,13.11
N$23  (via drill 0.35)
  Top 0.152: v36.27,19.81 36.42,19.96 36.42,30.33 34.9,31.85 33.38,31.85 30.79,34.44 12.8,34.44 9.81,37.43 9.62,37.43 9.33,37.72 7.5,37.72 7.5,39.23 7.58,39.3 7.58,40.32 LED1.3
  Route15 0.152: v36.27,19.81 36.27,16.31 v34.14,14.17
  Bottom 0.152: v34.14,14.17 34.14,12.95 33.83,12.65 33.83,12.04 35.51,10.36 36.27,10.36 37.34,9.3 R18.2
N$24  (via drill 0.35)
  Top 0.152: U1.38 22.55,20.27 23.01,20.27 24.38,18.9 24.38,17.41 24.59,17.21 25.41,17.21 25.73,16.89 25.73,16.02 27.59,14.17 27.96,14.17 28.5,13.64 28.5,13.26 28.96,12.8 28.96,12.24 30.48,10.72 v30.48,8.38 28.96,9.91 28.96,10.73 28.68,10.73 28.6,10.82 28.27,10.82 28.19,10.89 28.19,11.22 27.83,11.58 27.28,11.58 26.98,11.28 26.98,5.64 26.52,5.18 24.99,5.18 23.77,3.96 16.31,3.96 15.85,4.42 15.85,6.1 17.3,7.55 v17.3,11.23
  Bottom 0.152: v30.48,8.38 30.48,7.32 31.7,6.1 R9.1 | v17.3,11.23 17.22,11.32 17.22,12.5 R10.2
N$25  (via drill 0.35)
  Top 0.152: LED1.4 6.9,37.44 6.92,37.41 9.2,37.41 13.88,32.73 v14.58,32.73
  Bottom 0.152: v14.58,32.73 14.58,29.69 15.22,29.04 15.22,27.59 15.55,27.27 15.55,25.35 15.83,25.07 15.83,24.62 15.56,24.35 R19.2
N$26  (via drill 0.35)
  Top 0.152: v9.45,38.86 9.45,40.39 8.84,41 LED1.2
  Bottom 0.152: R20.1 24.38,3.66 5.94,3.66 1.52,8.08 1.52,28.04 4.85,31.37 7.98,31.37 9.45,32.84 v9.45,38.86
PYRO1  (via drill 0.35)
  Top 0.152: U1.13 15.54,17.07 v13.72,17.07 13.56,17.07 12.95,17.68 12.95,18.29 13.09,18.43 13.09,29.09 v13.26,29.26
  Bottom 0.152: v13.72,17.07 13.72,12.8 14.17,12.34 R11.2 | v13.26,29.26 13.26,32.92 Q5.4
PYRO2  (via drill 0.35)
  Top 0.152: v15.39,30.02 13.11,30.02 12.65,29.57 12.65,28.96 12.78,28.83 12.78,20.85 12.19,20.27 11.12,20.27 10.36,19.51 10.36,18.44 11.12,17.68 12.04,17.68 13.26,16.46 14.02,16.46 14.17,16.61 15.54,16.61 U1.14 | v33.22,23.01 31.09,25.15 31.09,30.94 28.5,33.53 v21.95,33.53
  Bottom 0.152: v15.39,30.02 17.68,30.02 20.57,32.92 R13.2 20.73,33.07 21.18,33.53 v21.95,33.53 | Q1.4 34.84,14.85 33.53,16.16 33.53,22.71 v33.22,23.01
PYRO3  (via drill 0.35)
  Top 0.152: v16.81,16.91 16.46,16.56 16.46,15.85 U1.15 | v25.27,12.5 23.62,12.5 23.32,12.8 22.86,12.8 20.93,14.73 v20.46,14.73
  Route15 0.152: v27.43,16.22 31.82,16.22 36.02,20.42 36.52,20.42 38.89,18.05 v42.92,18.05
  Bottom 0.152: v16.81,16.91 17.57,17.68 19.05,17.68 20.46,16.27 20.46,15.88 v20.46,14.73 | v25.27,12.5 25.27,12.62 27.43,14.78 R15.2 27.55,16.11 v27.43,16.22 | Q2.4 40.24,15.07 40.24,15.44 40.55,15.75 42.21,15.75 42.92,16.46 v42.92,18.05
QSPI_CS  (via drill 0.35)
  Top 0.152: v20.27,7.47 20.27,10.52 v20.57,10.82 | v16.15,25.6 16.15,24.38 16.31,24.23 16.31,22.71 U1.56
  Route15 0.152: v20.57,10.82 20.57,11.43 16.15,15.85 v16.15,25.6
  Bottom 0.152: v20.27,7.47 19.81,7.01 19.05,7.01 R4.1 | v20.57,10.82 20.88,10.82 23.01,12.95 23.01,14.48 21.95,15.54 R3.1 | v16.15,25.6 16.46,25.6 20.37,29.51 20.37,29.72 22.5,31.85 24.08,31.85 L1.1
QSPI_SCK  (via drill 0.35)
  Top 0.152: v20.27,26.06 19.52,26.06 18.59,25.13 18.59,24.95 18.14,24.49 18.14,23.28 17.98,23.13 17.98,22.71 U1.52
  Route15 0.152: v20.27,26.06 20.88,26.06 24.59,29.77 24.59,29.95 26.49,31.85 v28.5,31.85
  Bottom 0.152: v28.5,31.85 30.18,33.53 30.18,33.68 30.94,34.44 31.24,34.44 L1.6
QSPI_SD0  (via drill 0.35)
  Top 0.152: U1.53 17.67,22.78 17.67,23.25 17.83,23.41 17.83,24.62 18.29,25.07 18.29,25.26 18.94,25.91 18.94,26.2 19.2,26.45 19.8,26.45 20.02,26.67 20.52,26.67 20.74,26.45 22.84,26.45 v22.95,26.34
  Route2 0.152: v22.95,26.34 24.26,27.64 24.26,29.19 26.09,31.02 26.73,31.02 28.95,33.23 28.95,34.74 29.83,35.62 v32.81,35.62
  Bottom 0.152: v32.81,35.62 31.48,35.62 L1.5
QSPI_SD1  (via drill 0.35)
  Top 0.152: v16.76,24.69 16.76,22.71 U1.55
  Route15 0.152: v16.76,24.69 17.53,24.69 18.75,25.91 18.75,28.5 v22.71,32.46
  Bottom 0.152: v22.71,32.46 23.16,32.46 24.08,33.38 L1.2
QSPI_SD2  (via drill 0.35)
  Top 0.152: U1.54 17.22,22.71 17.22,24.23 17.53,24.54 17.53,24.75 17.98,25.2 17.98,25.38 17.98,25.39 v17.98,26.21
  Route15 0.152: v17.98,26.21 17.98,27.74 v17.83,27.89
  Bottom 0.152: v17.83,27.89 17.83,28.5 23.77,34.44 24.08,34.44 L1.3
QSPI_SD3  (via drill 0.35)
  Top 0.152: U1.51 18.44,22.71 18.44,24.37 18.89,24.82 18.89,25 19.34,25.45 20.52,25.45 21.13,26.06 22.16,26.06 23.27,24.94 25.01,24.94 26.09,26.02 27.83,26.02 v29.19,24.65
  Route15 0.152: v29.19,24.65 29.19,28.43 32.77,32 v32.77,33.38
  Bottom 0.152: v32.77,33.38 31.39,33.38 L1.7
RST  (via drill 0.35)
  Top 0.152: v33.38,14.94 36.27,14.94 39.17,17.83 39.17,18.29 X1.1 | U1.26 20.8,15.3 22.99,13.11 24.54,13.11 v24.79,13.36
  Route15 0.152: v24.79,13.36 26.82,13.36 27.33,13.87 30.16,13.87 v33.52,10.5
  Bottom 0.152: R6.2 32.16,18.14 32.16,16.61 33.38,15.39 v33.38,14.94 33.38,12.65 31.85,11.12 R5.2 32.95,11.08 v33.52,10.5
RX0  (via drill 0.35)
  Top 0.152: v23.62,14.02 21.95,15.7 21.64,15.7 U1.28
  Bottom 0.152: v23.62,14.02 23.62,12.95 20.27,9.6 20.27,8.84 19.96,8.53 14.17,8.53 11.79,10.92 11.79,13.44 11.73,13.49 11.73,16.31 J2.1
RXE  (via drill 0.35)
  Top 0.152: v54.25,32.92 54.25,35.51 56.51,37.77 59.47,37.77 61.57,35.66 61.57,8.53 59.74,6.71 58.83,6.71 57.76,7.77 57.76,12.67 55.33,12.67 44.8,2.13 38.56,2.13 37.34,3.35 X1.15
  Bottom 0.152: v54.25,32.92 54.25,33.22 54.86,33.83 55.63,33.83 IC3.20
SCK  (via drill 0.35)
  Top 0.152: 31.24,22.4 31.24,18.44 X1.5 | U1.4 15.54,20.73 14.94,20.73 13.74,21.92 13.74,26.76 13.95,26.97 22.9,26.97 22.93,26.94 23.2,26.94 23.56,26.59 23.56,26.2 25.84,26.2 25.96,26.32 26.61,26.32 26.65,26.36 28.34,26.36 31.24,23.46 31.24,22.4 | v49.99,30.94 v54.41,26.52 | 31.24,22.4 33.53,22.4 33.98,22.86 33.98,23 33.83,23.16 33.83,23.26 32.92,24.18 32.92,29.56 v34.59,31.24
  Bottom 0.152: v54.41,26.52 54.41,25.28 60.48,19.2 62.03,19.2 J1.5 | v49.99,30.94 39.78,30.94 37.34,33.38 37.03,33.38 L2.6 36.88,33.53 v34.59,31.24
SCL  (via drill 0.35)
  Top 0.152: v16.76,21.49 16.31,21.03 15.7,21.03 U1.3 | 50.29,22.71 50.29,22.1 49.99,21.79 IC2.8 | 50.29,22.71 50.29,24.38 47.55,27.12 47.55,30.48 HM1.4 47.55,30.63 50.14,33.22 v50.14,36.73 | v42.06,5.79 37.64,5.79 35.36,3.5 X1.14 | 50.29,22.71 v50.6,22.71
  Bottom 0.152: v16.76,21.49 13.87,18.59 12.95,18.59 12.04,17.68 10.36,17.68 7.3,17.68 | 7.3,17.68 5.94,17.68 4.27,16 4.27,15.54 3.5,14.78 2.59,14.78 1.83,14.02 1.83,9.6 2.9,8.53 J3.1 | v42.06,5.79 42.06,6.1 48.16,12.19 50.14,12.19 51.93,13.98 51.93,21.37 v50.6,22.71 | v50.14,36.73 50.14,41.15 49.23,42.06 20.27,42.06 15.85,37.64 14.94,37.64 12.5,35.2 12.5,32.77 10.36,30.63 7.3,27.57 7.3,17.68
SD_CS  (via drill 0.35)
  Top 0.152: v13.56,17.98 13.56,19.05 15.54,19.05 U1.8
  Route15 0.152: v13.56,17.98 13.11,17.53 13.11,14.48 19.66,7.92 19.66,7.16 v21.64,5.18
  Bottom 0.152: v21.64,5.18 24.69,5.18 25.45,4.42 25.45,2.59 25.6,2.44 33.83,2.44 33.98,2.59 39.17,2.59 39.47,2.29 48.31,2.29 62.03,16 J1.2
SD_DETECT  (via drill 0.35)
  Top 0.152: v28.37,11.95 28.43,12.01 28.43,12.87 28.19,13.11 28.19,13.51 27.84,13.87 27.46,13.87 25.43,15.89 25.43,15.94 23.7,17.66 23.15,17.66 22.95,17.87 U1.32
  Route2 0.152: v28.37,11.95 29.26,11.95 29.47,11.74 42.94,11.74 47.19,15.99 49.77,15.99 v51.24,17.46
  Bottom 0.152: v51.24,17.46 51.01,17.23 J1.10
SDA  (via drill 0.35)
  Top 0.152: v17.37,25.45 16.34,26.49 14.05,26.49 14.05,22.52 15.09,21.49 15.54,21.49 U1.2 | HM1.3 47.4,31.24 47.24,31.24 46.94,30.94 46.94,27.27 49.99,24.22 49.99,22.55 49.68,22.25 49.53,22.25 49.38,22.1 49.38,21.18 49.53,21.03 49.53,20.73 IC2.9 49.53,20.57 49.53,20.27 33.38,4.12 33.38,3.5 X1.13 33.22,3.35 33.22,2.9 32.16,1.83 7.62,1.83 6.25,3.2 6.25,6.86 3.05,10.06 3.05,10.82 J3.2
  Route2 0.152: v17.37,25.45 17.37,23.93 12.95,19.51 12.95,15.85 8.53,11.43 4.27,11.43 3.96,11.12 3.2,11.12 3.05,10.97 J3.2
SERVO1  (via drill 0.35)
  Top 0.152: U1.16 16.8,15.4 16.48,15.08 15.36,15.08 15.08,15.36 14.57,15.36 14.29,15.08 10.12,15.08 v8.98,13.95
  Route2 0.152: v8.98,13.95 6.98,15.95 6.98,16.43 4.34,19.07 SERVO1.1
SERVO2  (via drill 0.35)
  Top 0.152: v14.79,13.82 14.59,14.02 10.42,14.02 9.75,13.34 8.36,13.34 7.63,14.07 7.63,14.95 7.16,15.42 7.16,17.83 5.94,19.05 SERVO2.1 | U1.17 17.22,15.7 17.22,15.39 16.89,15.05 16.89,14.47 v16.02,14.47
  Bottom 0.152: v16.02,14.47 15.44,14.47 v14.79,13.82
SERVO3  (via drill 0.35)
  Top 0.152: U1.18 17.54,15.78 17.54,15.05 17.22,14.72 17.22,12.2 16.97,11.96 13.88,11.96 v12.65,13.19
  Route15 0.152: v12.65,13.19 9.52,16.32 9.52,16.43 8.66,17.29 SERVO3.1
TX0  (via drill 0.35)
  Top 0.152: v24.23,14.78 24.23,13.72 23.93,13.41 23.16,13.41 21.18,15.39 21.18,15.7 U1.27
  Bottom 0.152: v24.23,14.78 24.23,15.39 16.15,23.47 14.33,23.47 12.8,21.95 12.8,20.12 11.73,19.05 J2.2
TXE  (via drill 0.35)
  Top 0.152: v58.98,24.69 57,24.69 47.09,14.78 47.09,9.45 47.24,9.3 47.24,8.38 42.37,3.5 39.32,3.5 X1.16
  Bottom 0.152: v58.98,24.69 62.33,28.04 62.33,31.7 62.03,32 61.27,32 IC3.4
USBD+  (via drill 0.35)
  Top 0.152: v19.96,23.77 19.96,22.71 U1.47 | v14.82,14.75 15.39,14.19 15.39,14.03 16.46,12.95 S1.8
  Route2 0.152: v19.96,23.77 19.67,23.48 19.67,22.12 18.93,21.38 18.93,19.29 18.01,18.36 17.09,18.36 17.02,18.44 16.46,18.44 14.82,16.81 v14.82,14.75
USBD+1  (via drill 0.35)
  Top 0.152: v24.23,11.58 24.08,11.58 23.16,12.5 22.74,12.5 21.21,14.02 19.96,14.02 19.2,13.26 19.2,12.95 S1.6
  Route15 0.152: v24.23,11.58 26.06,11.58 28.65,8.99 33.59,8.99 42.05,17.45 43.4,17.45 44.61,18.66 45.64,18.66 54.56,27.58 56.08,27.58 56.69,28.19 57.3,28.19 v57.91,27.58
  Bottom 0.152: v57.91,27.58 57.3,26.98 56.69,26.98 55.78,27.89 55.78,28.19 IC3.11
USBD-  (via drill 0.35)
  Top 0.152: v18.14,14.78 18.14,13.26 17.83,12.95 S1.7 | U1.46 20.42,22.71 20.42,23.16 20.63,23.37 22.96,23.37 23.86,22.48 23.86,20.5 v23.77,20.42
  Route2 0.152: v18.14,14.78 v23.77,20.42
USBD-1  (via drill 0.35)
  Top 0.152: v23.62,10.36 23.62,10.82 21.64,12.8 20.42,12.8 S1.5
  Route15 0.152: v23.62,10.36 24.69,10.36 27.28,7.77 37.19,7.77 v57,27.58
  Bottom 0.152: v57,27.58 57,28.35 56.54,28.8 55.78,28.8 IC3.12
VIN
  Top 1: C4.+ 17.25,31.97 17.79,31.43 24.48,31.43 CON1.+
  Bottom 0.152: R16.1 37.3,7.88 R9.2
  Bottom 1: 50.43,29.01 50.43,26.19 48.48,24.24 48.48,16.44 49.2,15.72 49.2,14.07 48.86,14.07 40.61,5.82 R16.1
  Bottom 1.5: R12.2 22.5,23.89 24.23,25.62 24.23,26.28 CON1.+
  Bottom 2: 36.08,29.01 37.27,27.82 37.27,26.12 36,24.85 R14.2 | 36.08,29.01 50.43,29.01 R17.2 | 36.08,29.01 26.96,29.01 CON1.+

### Text on the board
tNames: Brian Wong, 2023
bNames: Brian Wong, 2023